# EAGLE schematic pdp8i-io (EAGLE 6.6.0), part 2 of 2
## Sheet 25 of 40
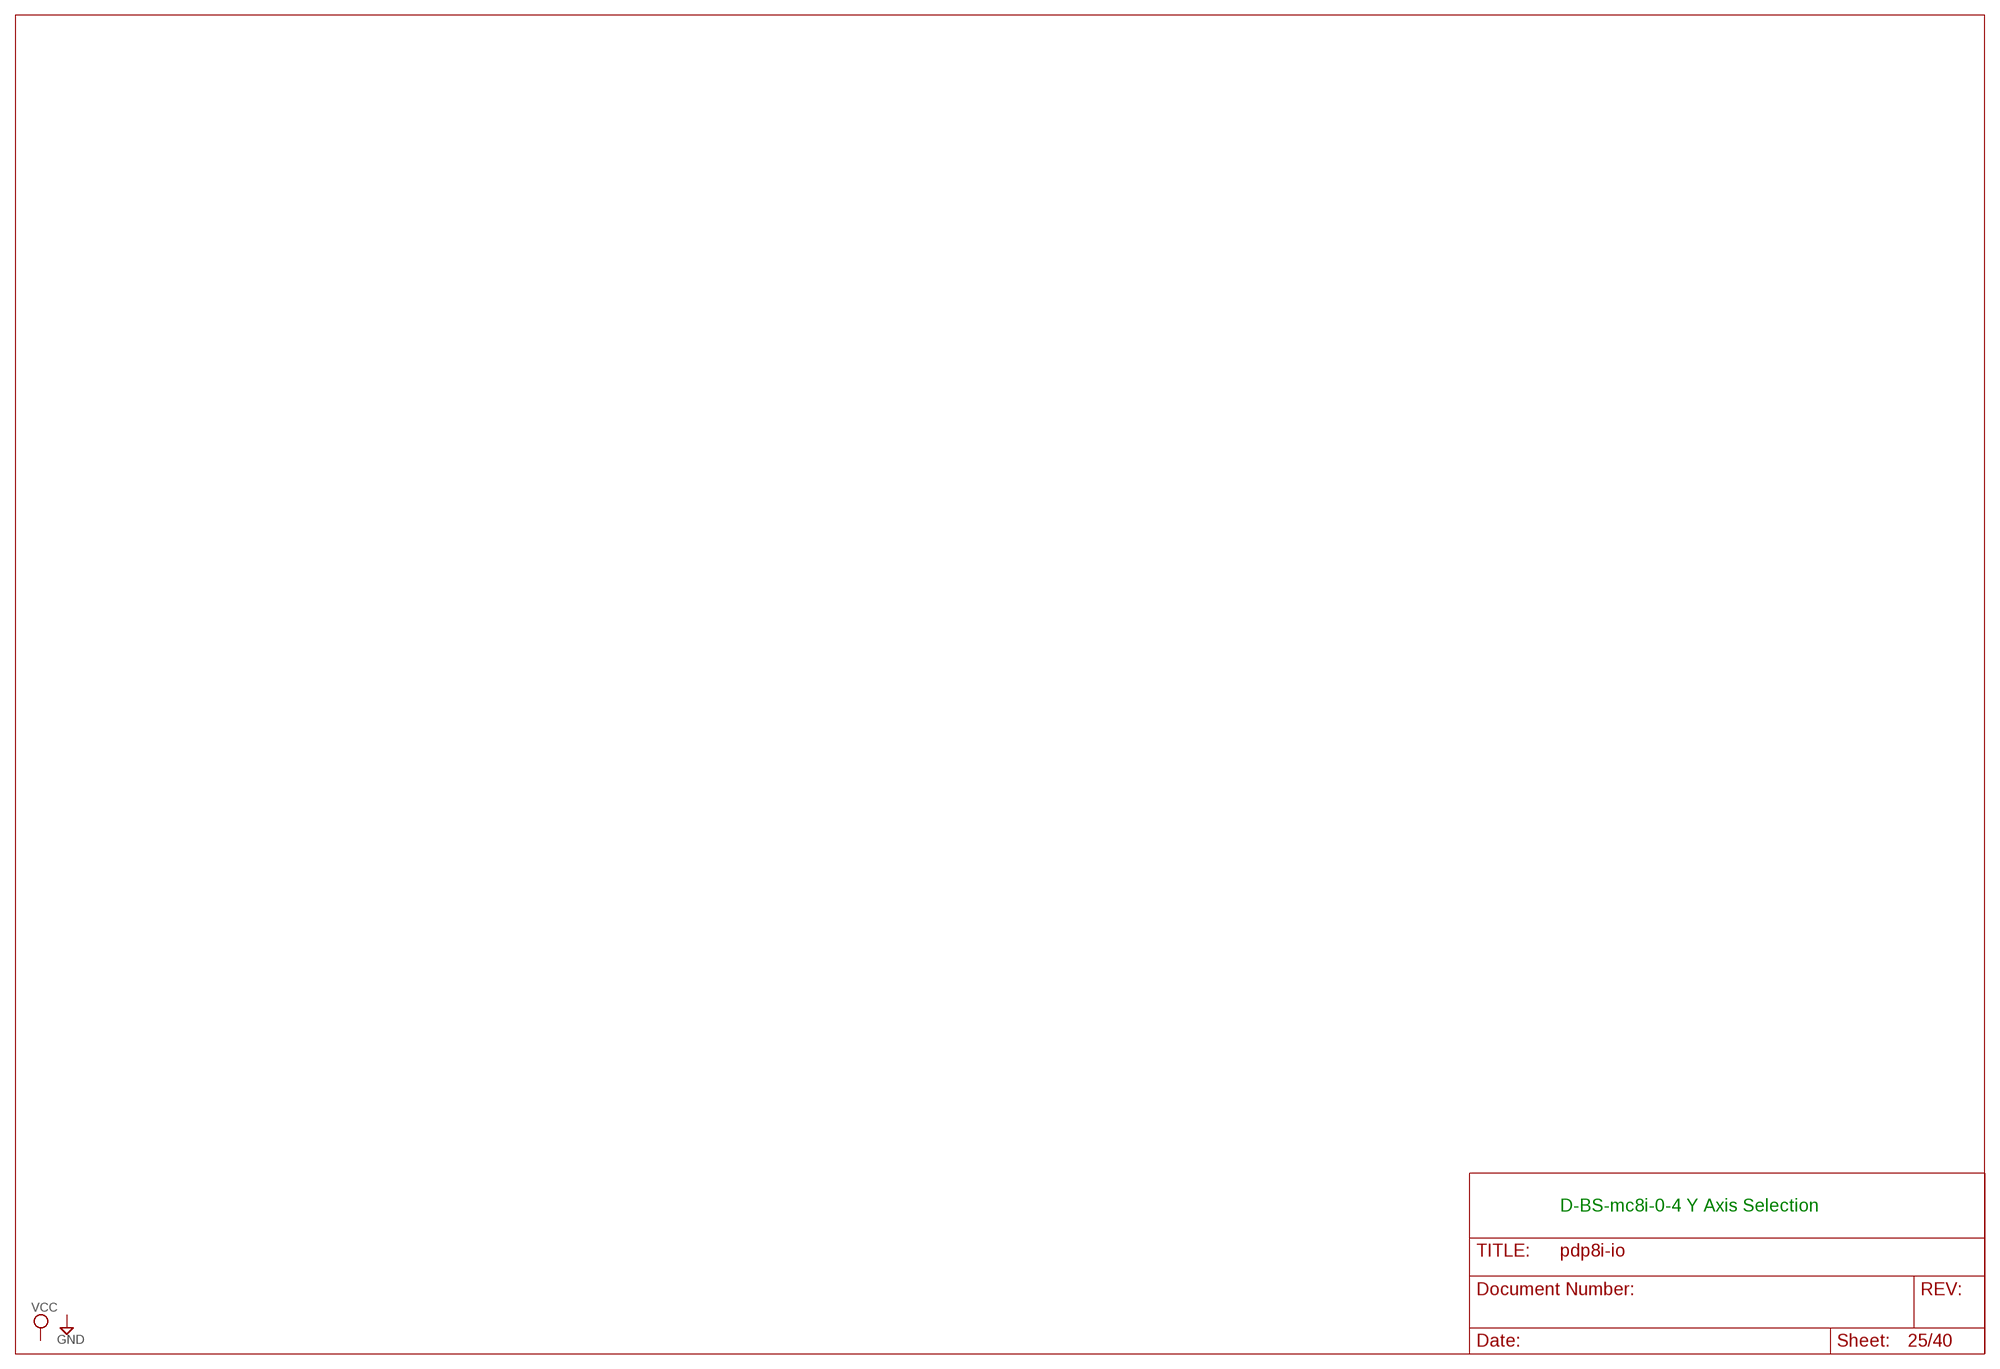
[diagram p24: schematic, sheet 25]

### Notes on the sheet
- D-BS-mc8i-0-4 Y Axis Selection

## Sheet 26 of 40
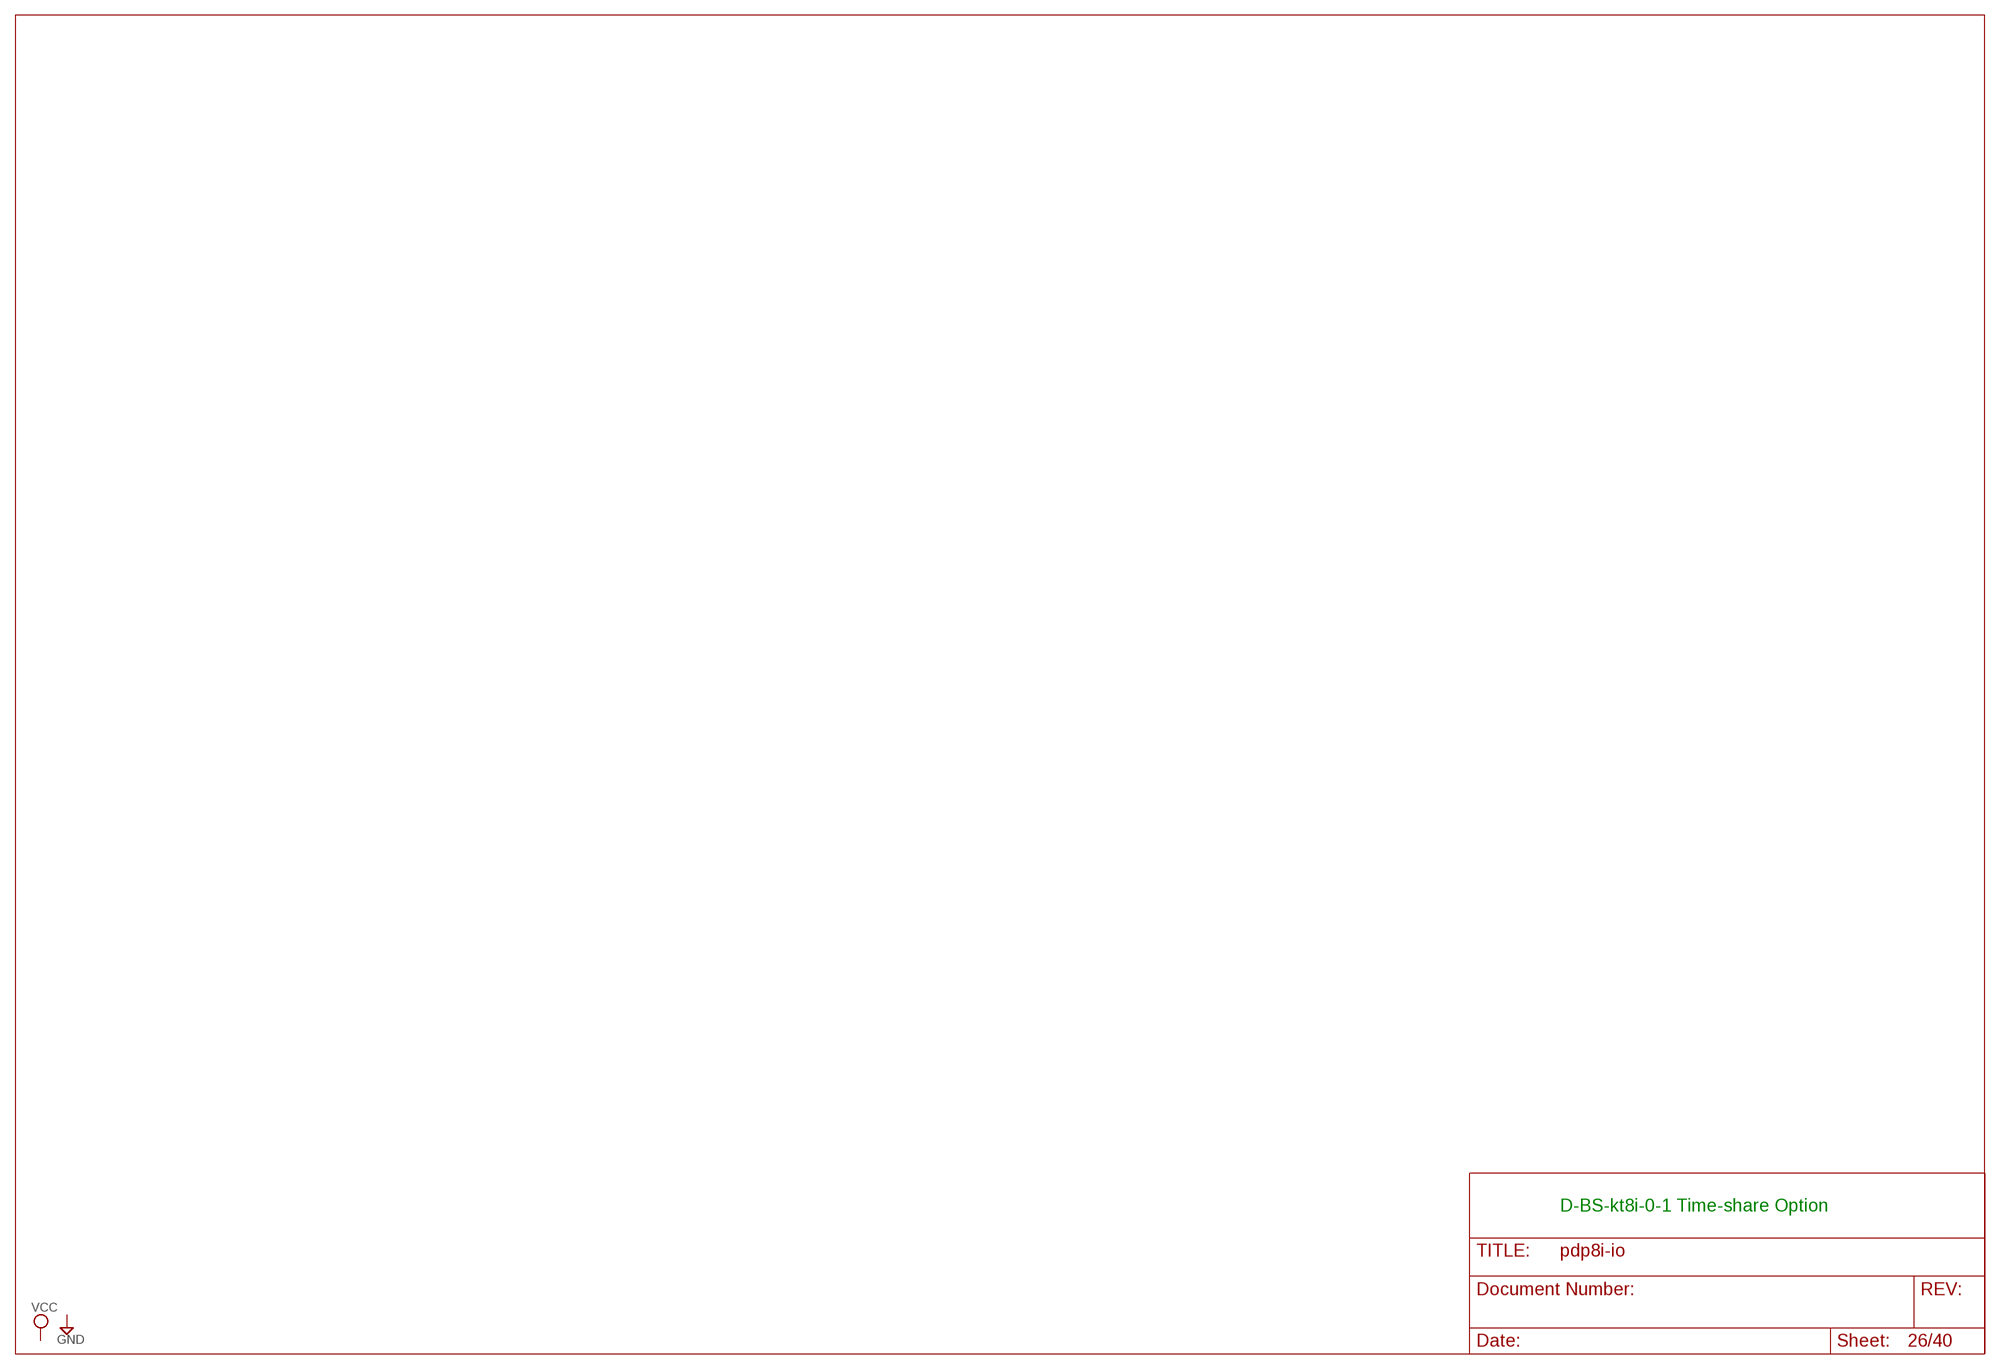
[diagram p25: schematic, sheet 26]

### Notes on the sheet
- D-BS-kt8i-0-1 Time-share Option

## Sheet 27 of 40
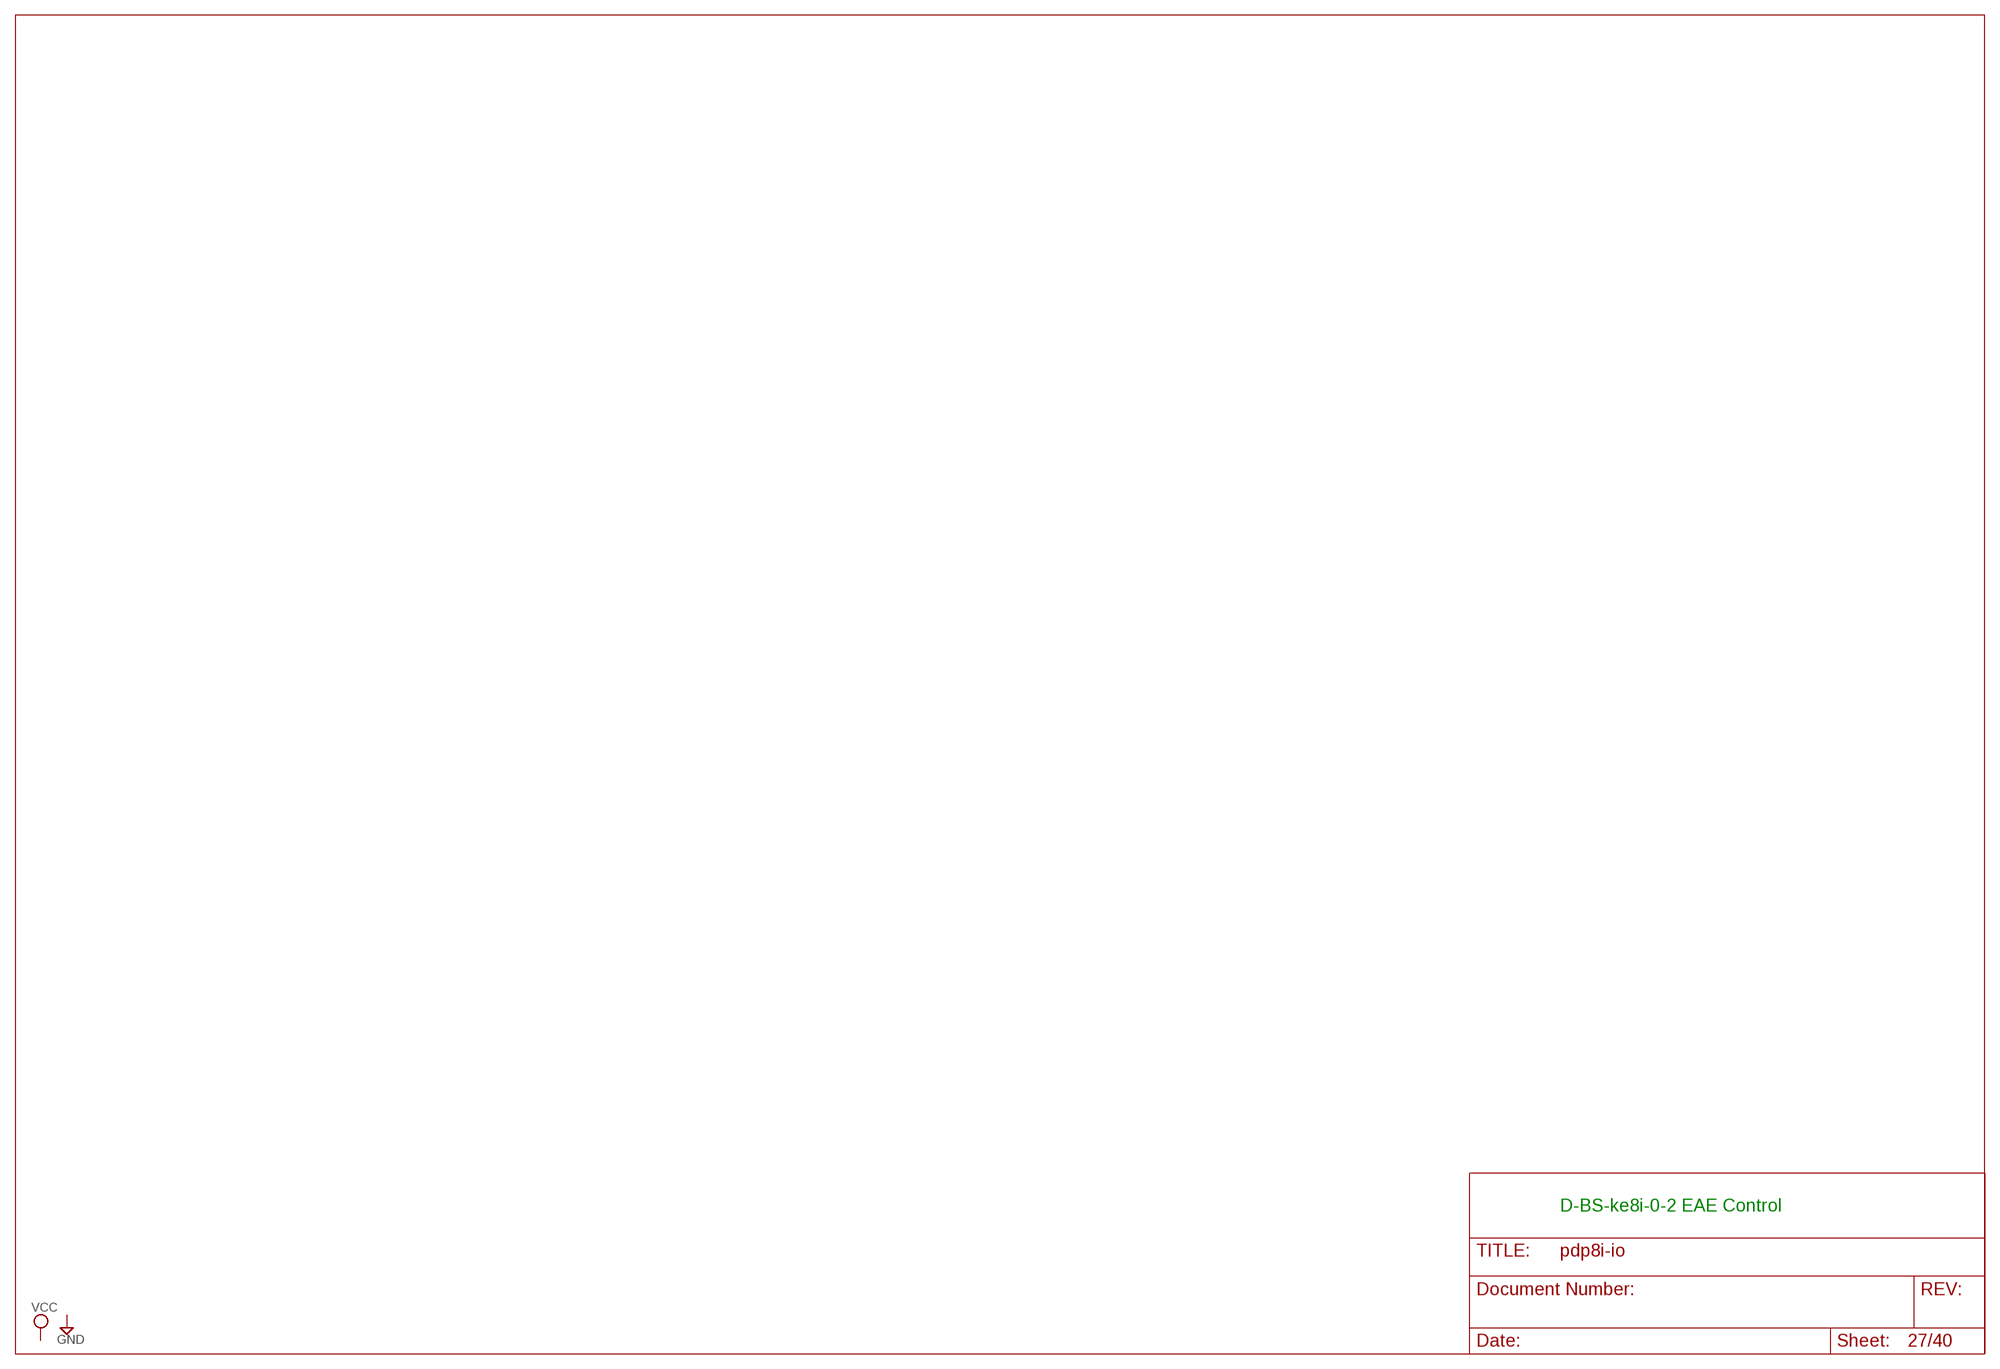
[diagram p26: schematic, sheet 27]

### Notes on the sheet
- D-BS-ke8i-0-2 EAE Control

## Sheet 28 of 40
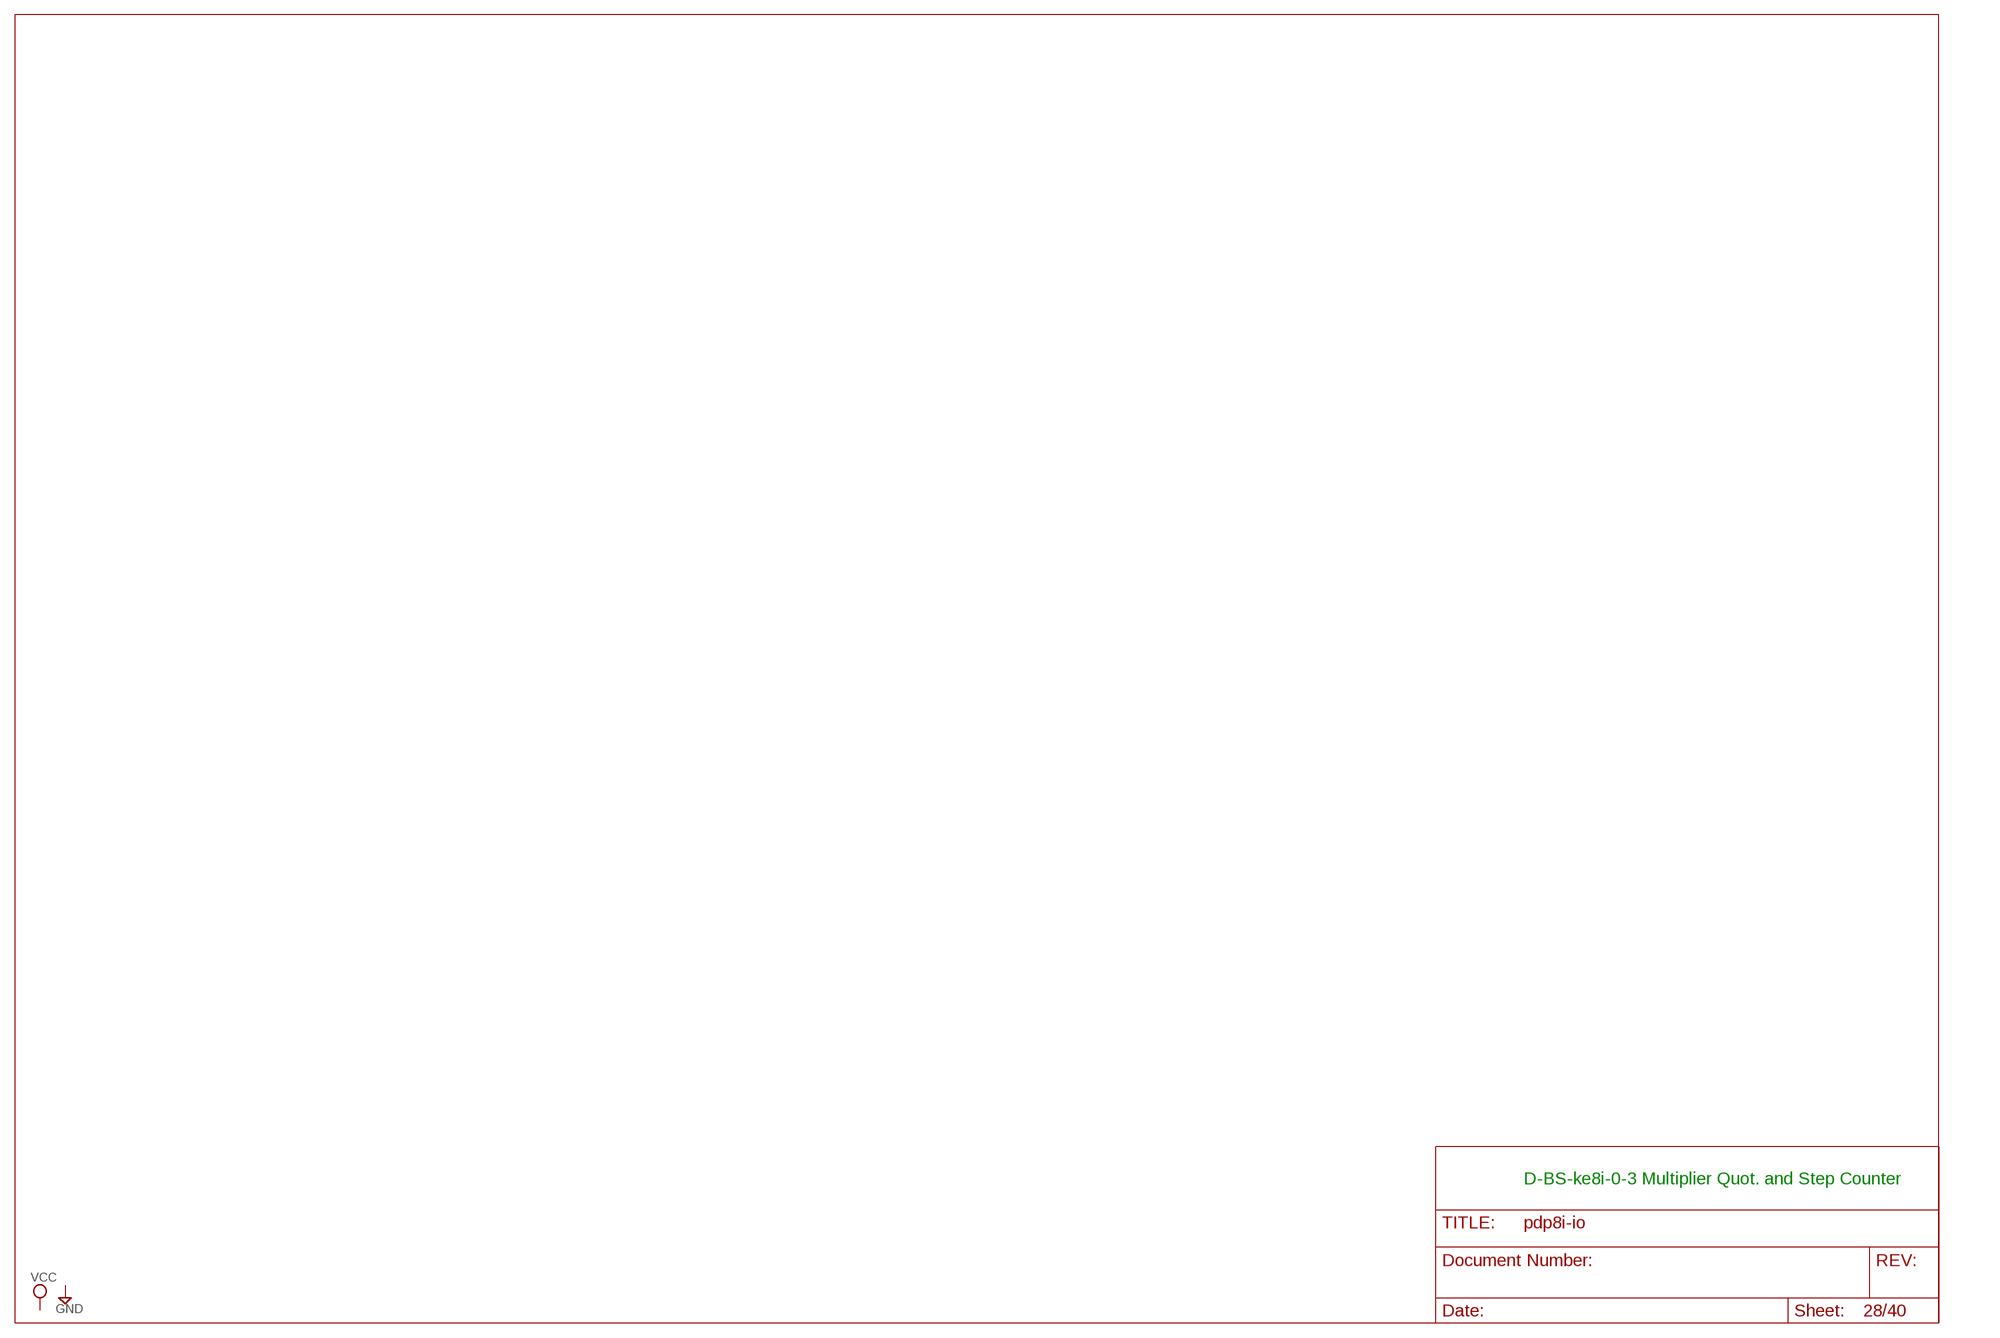
[diagram p27: schematic, sheet 28]

### Notes on the sheet
- D-BS-ke8i-0-3 Multiplier Quot. and Step Counter

## Sheet 29 of 40
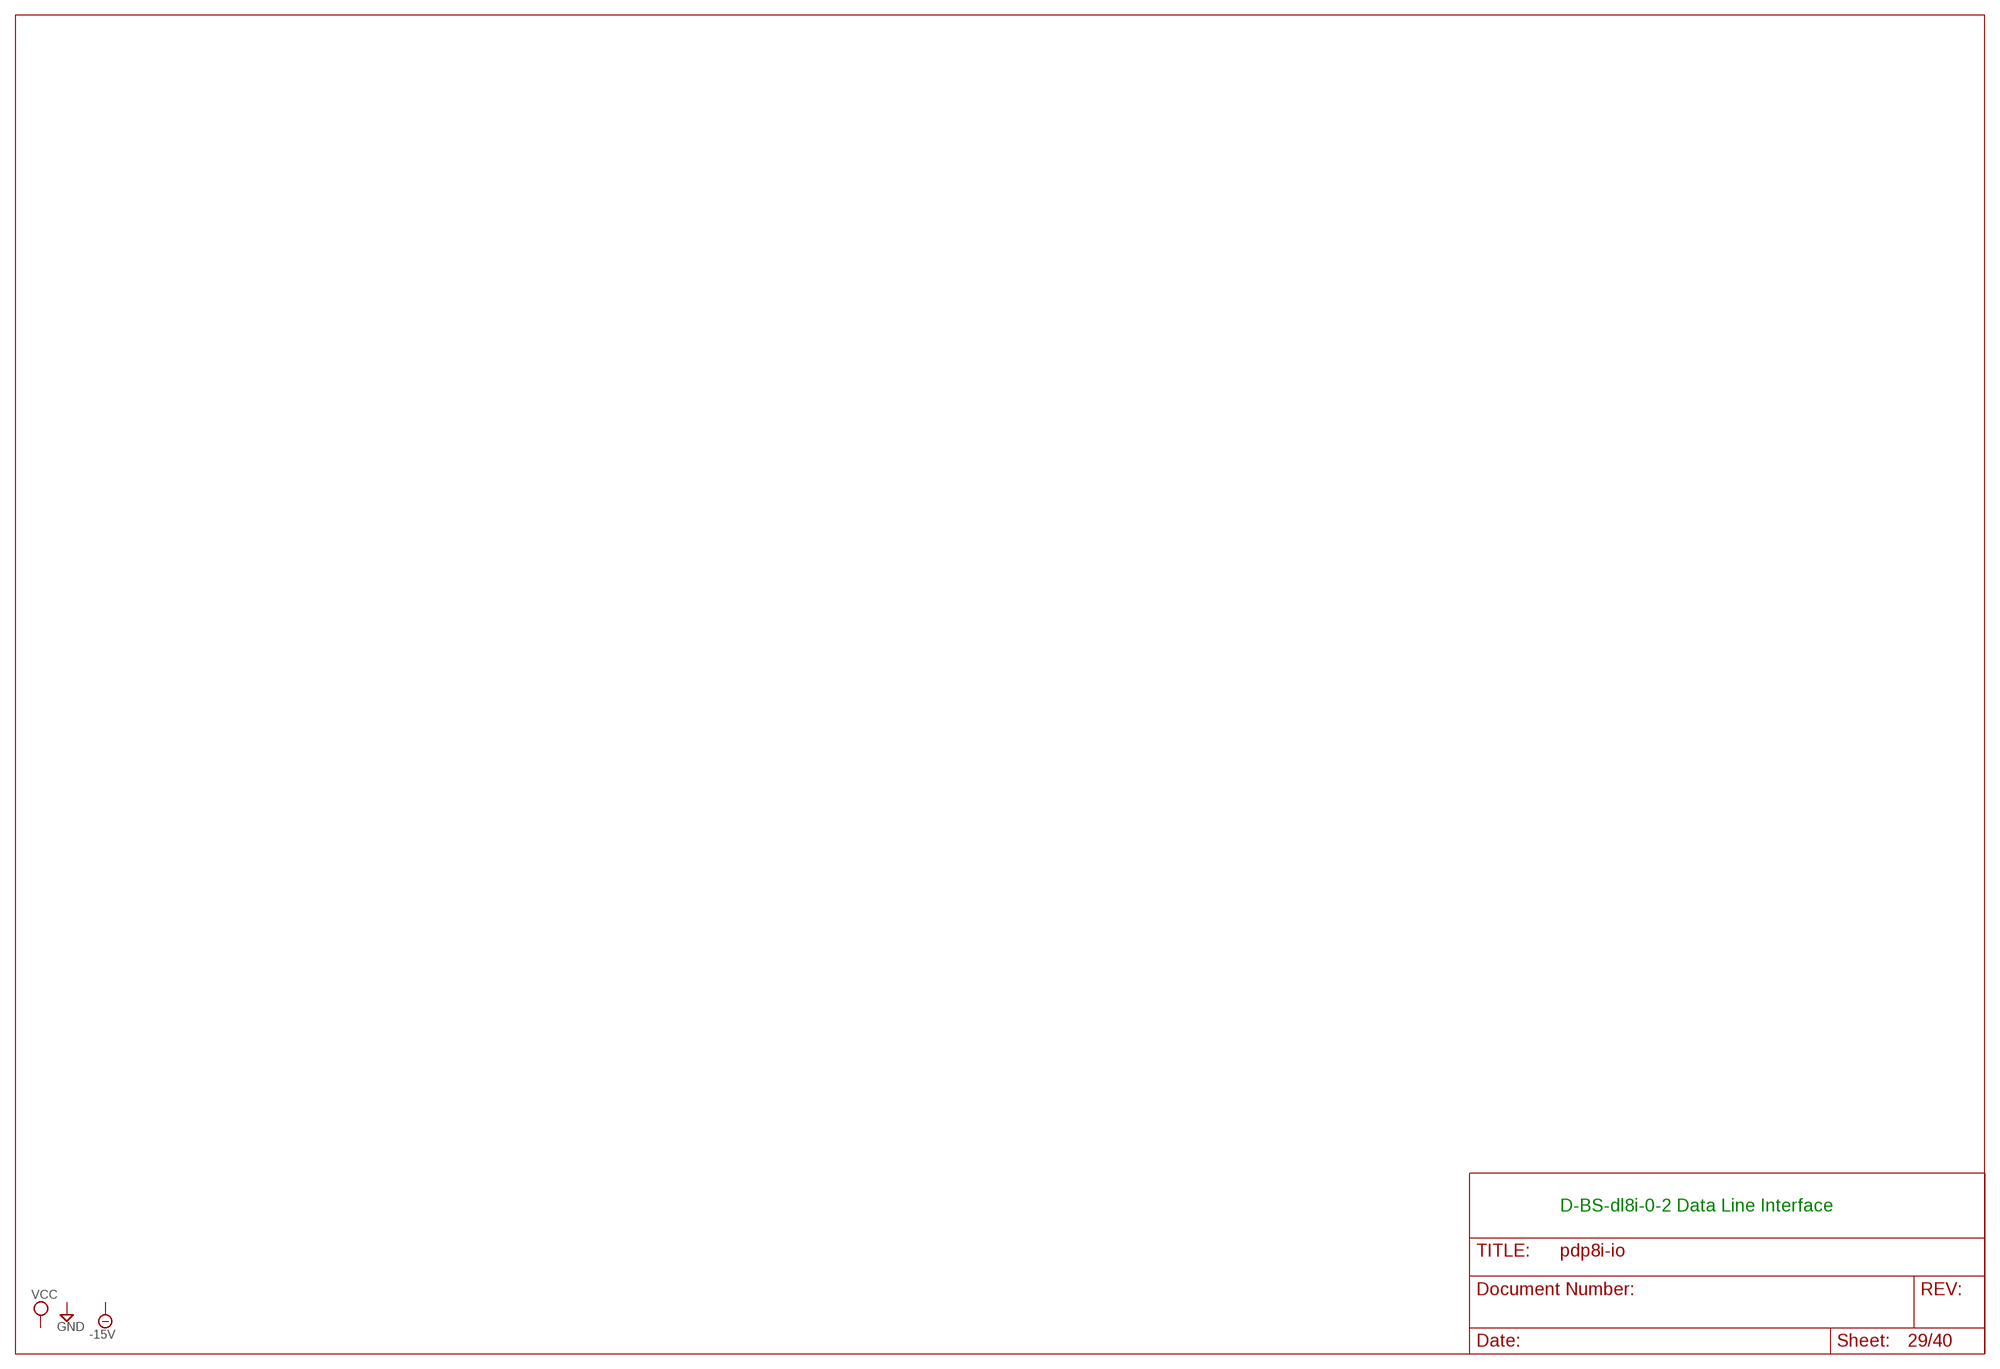
[diagram p28: schematic, sheet 29]

### Notes on the sheet
- D-BS-dl8i-0-2 Data Line Interface

## Sheet 30 of 40
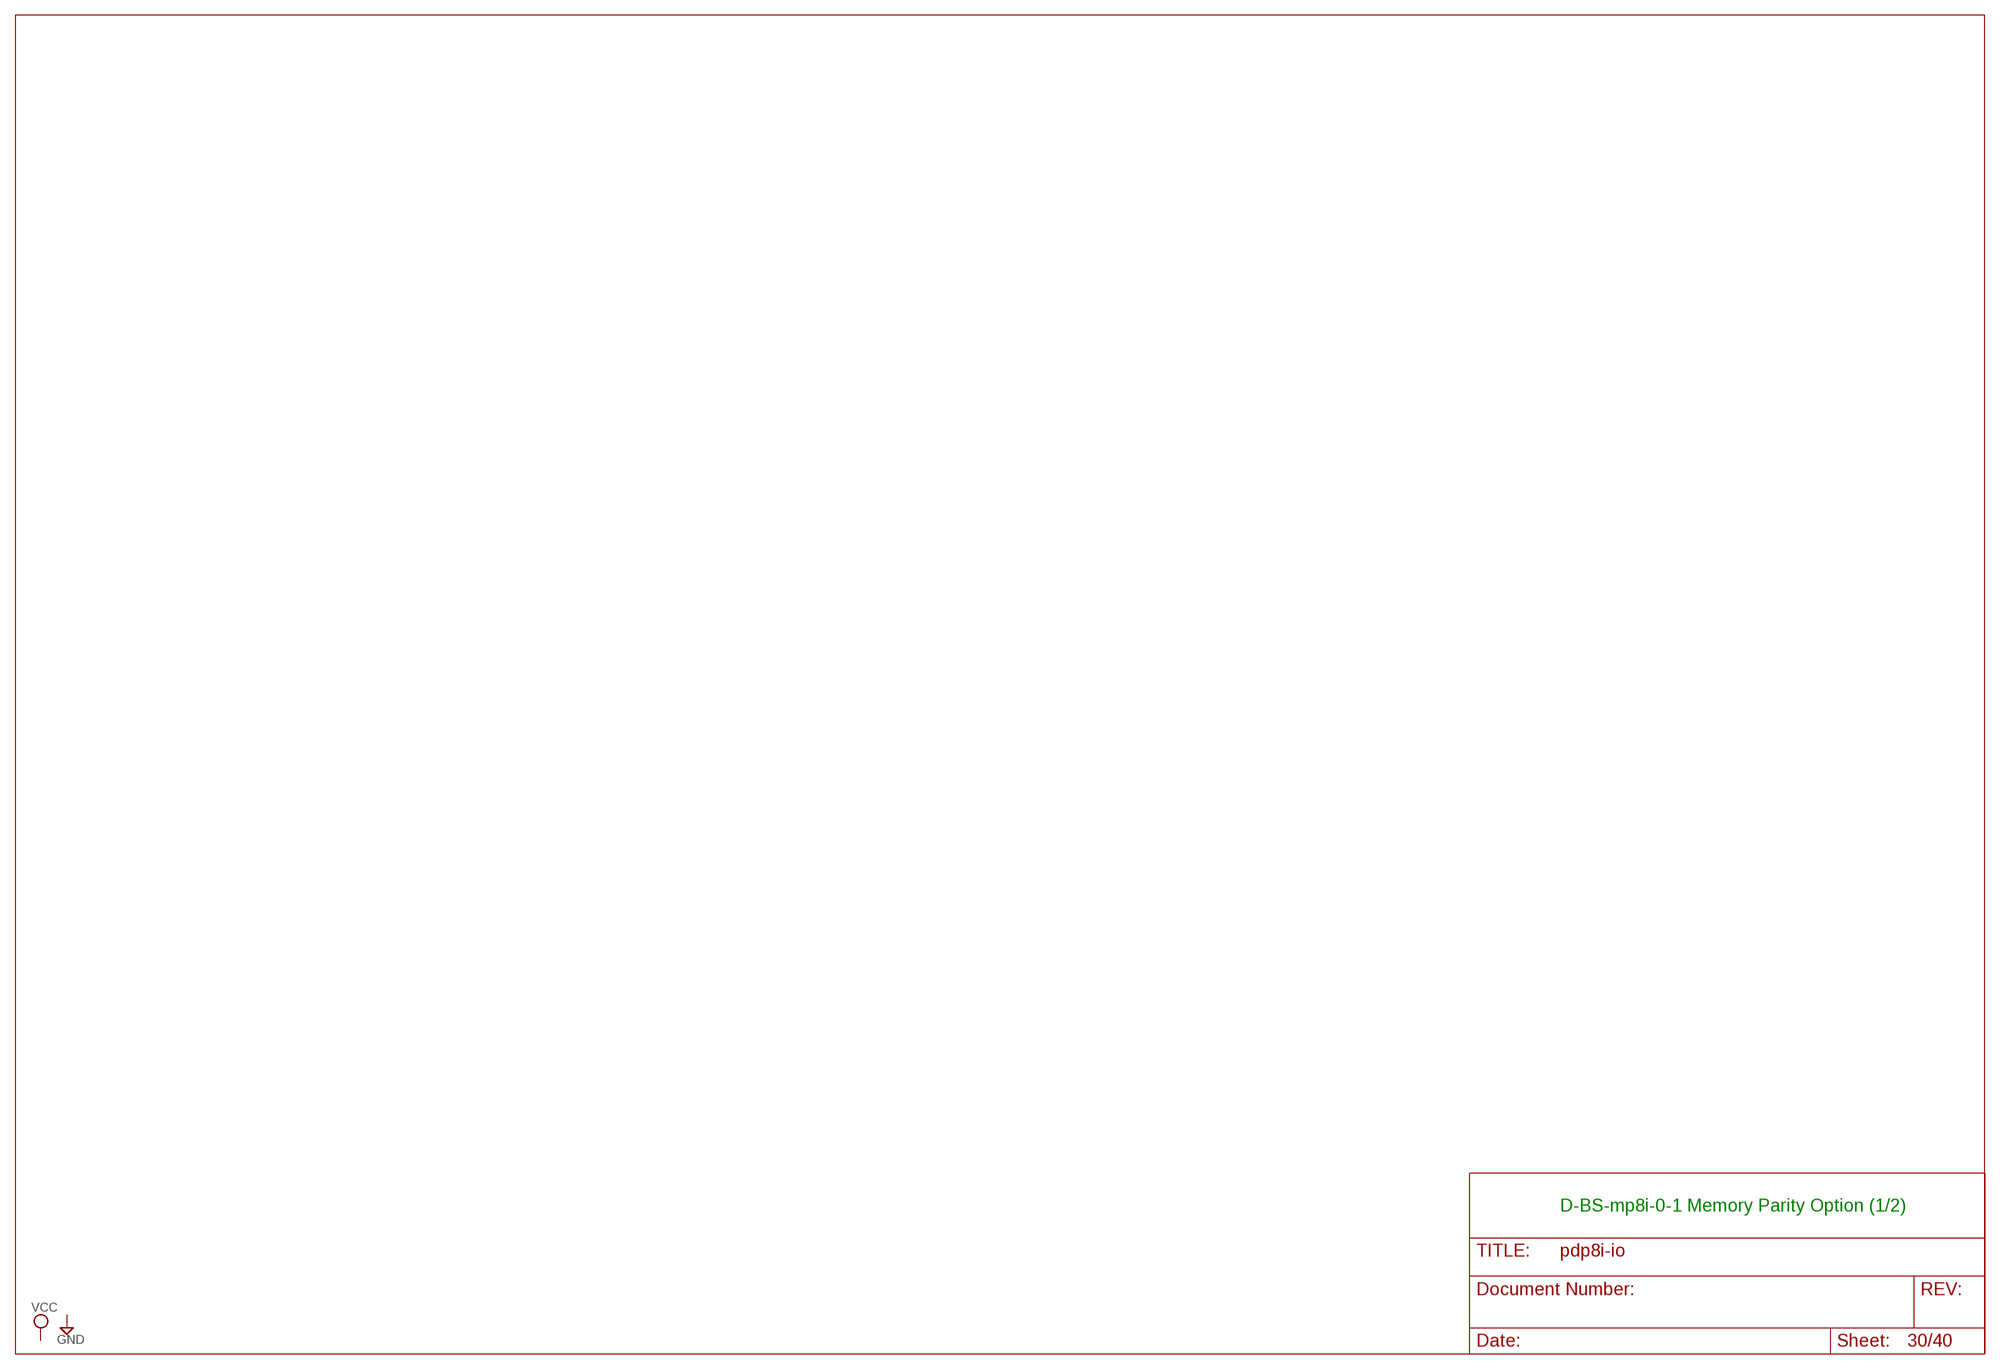
[diagram p29: schematic, sheet 30]

### Notes on the sheet
- D-BS-mp8i-0-1 Memory Parity Option (1/2)

## Sheet 31 of 40
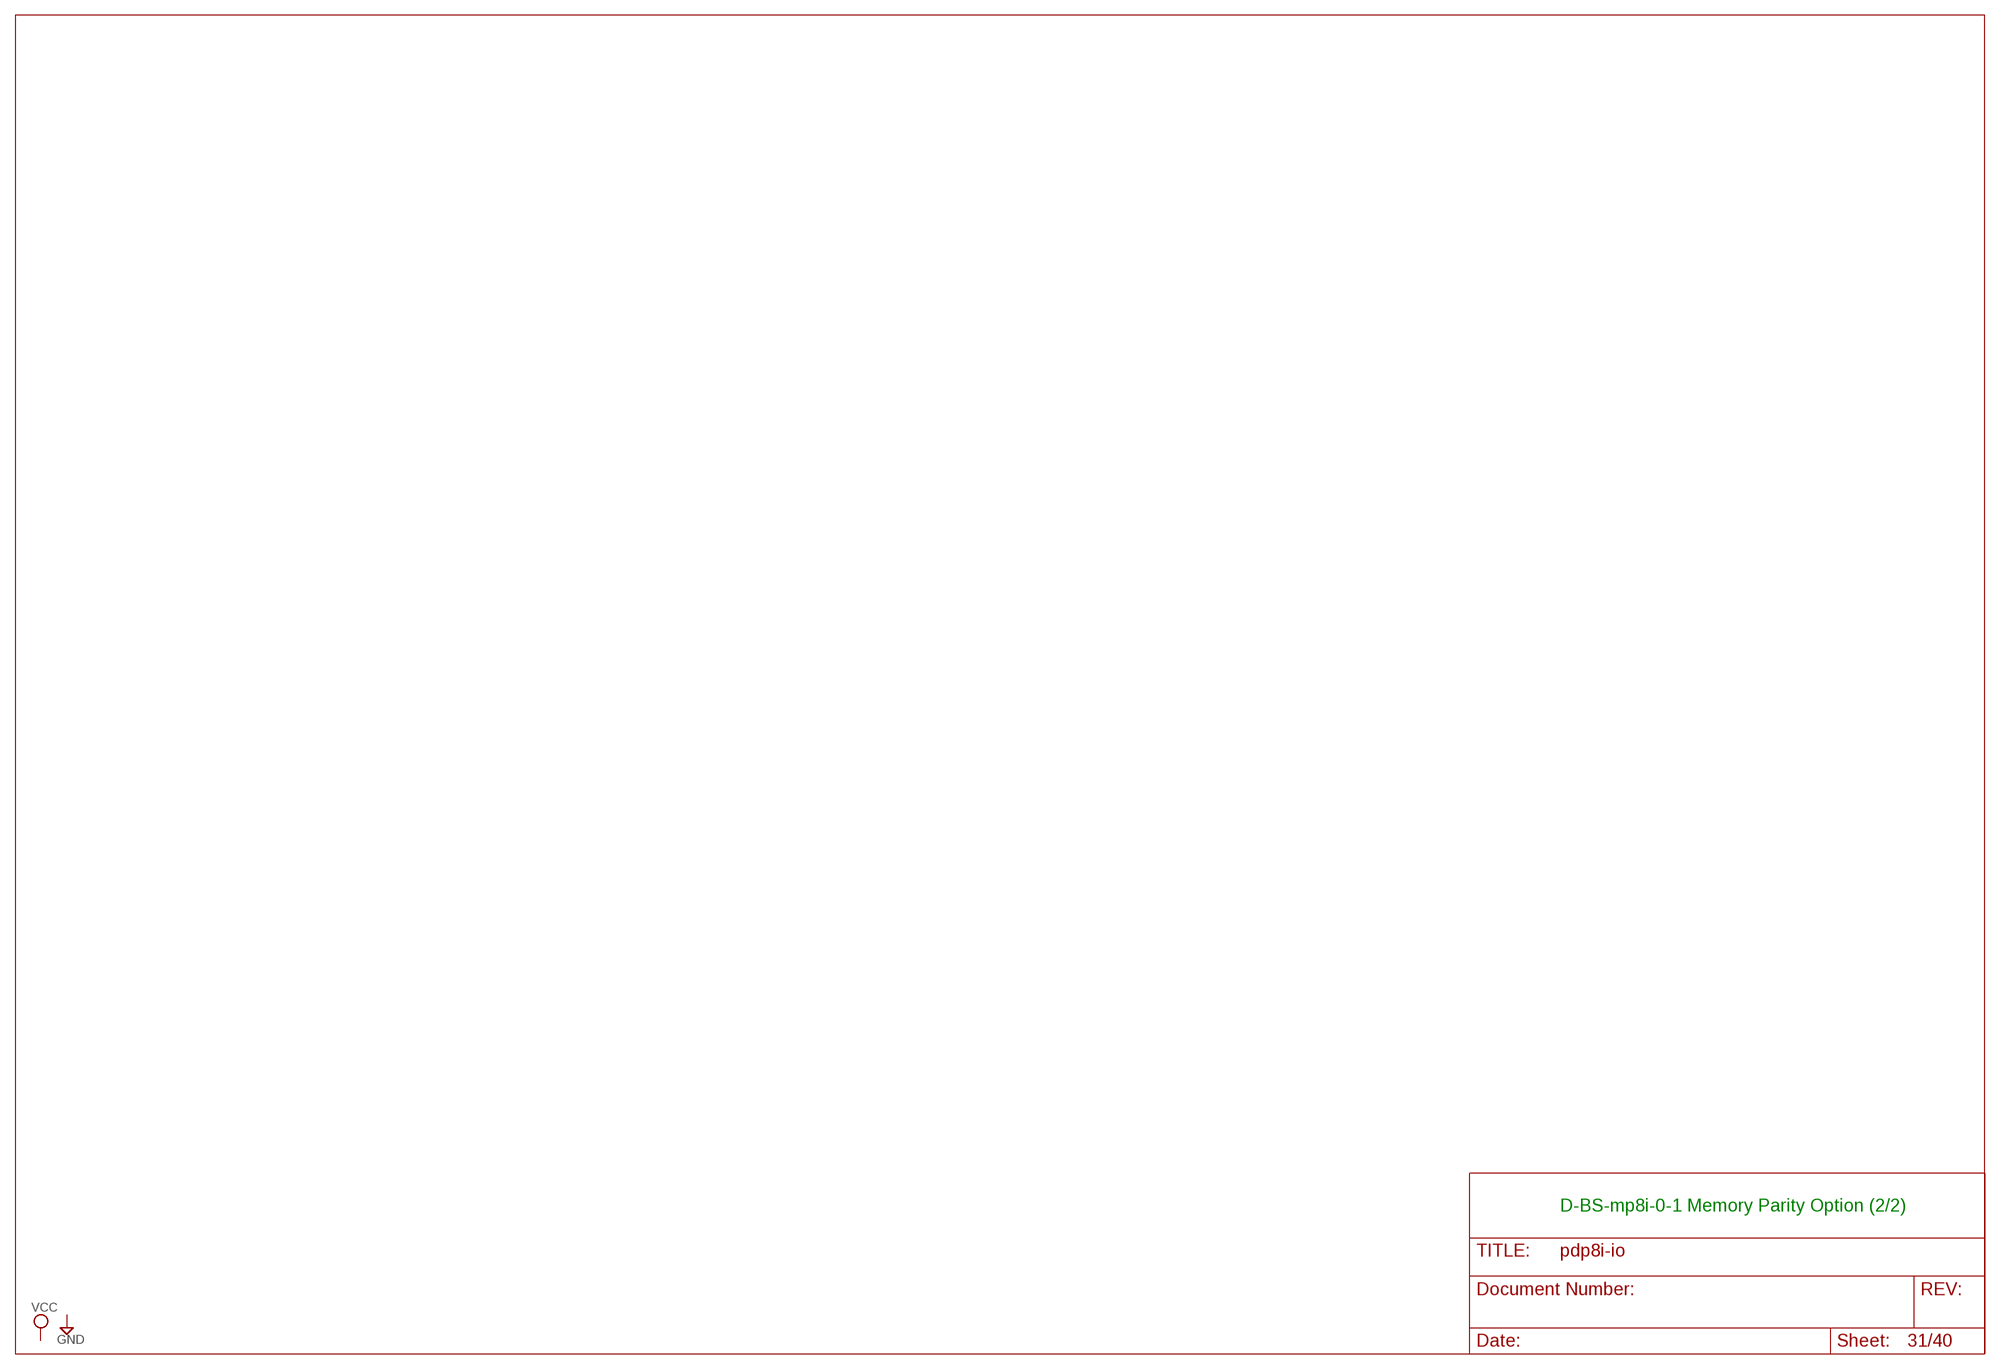
[diagram p30: schematic, sheet 31]

### Notes on the sheet
- D-BS-mp8i-0-1 Memory Parity Option (2/2)

## Sheet 32 of 40
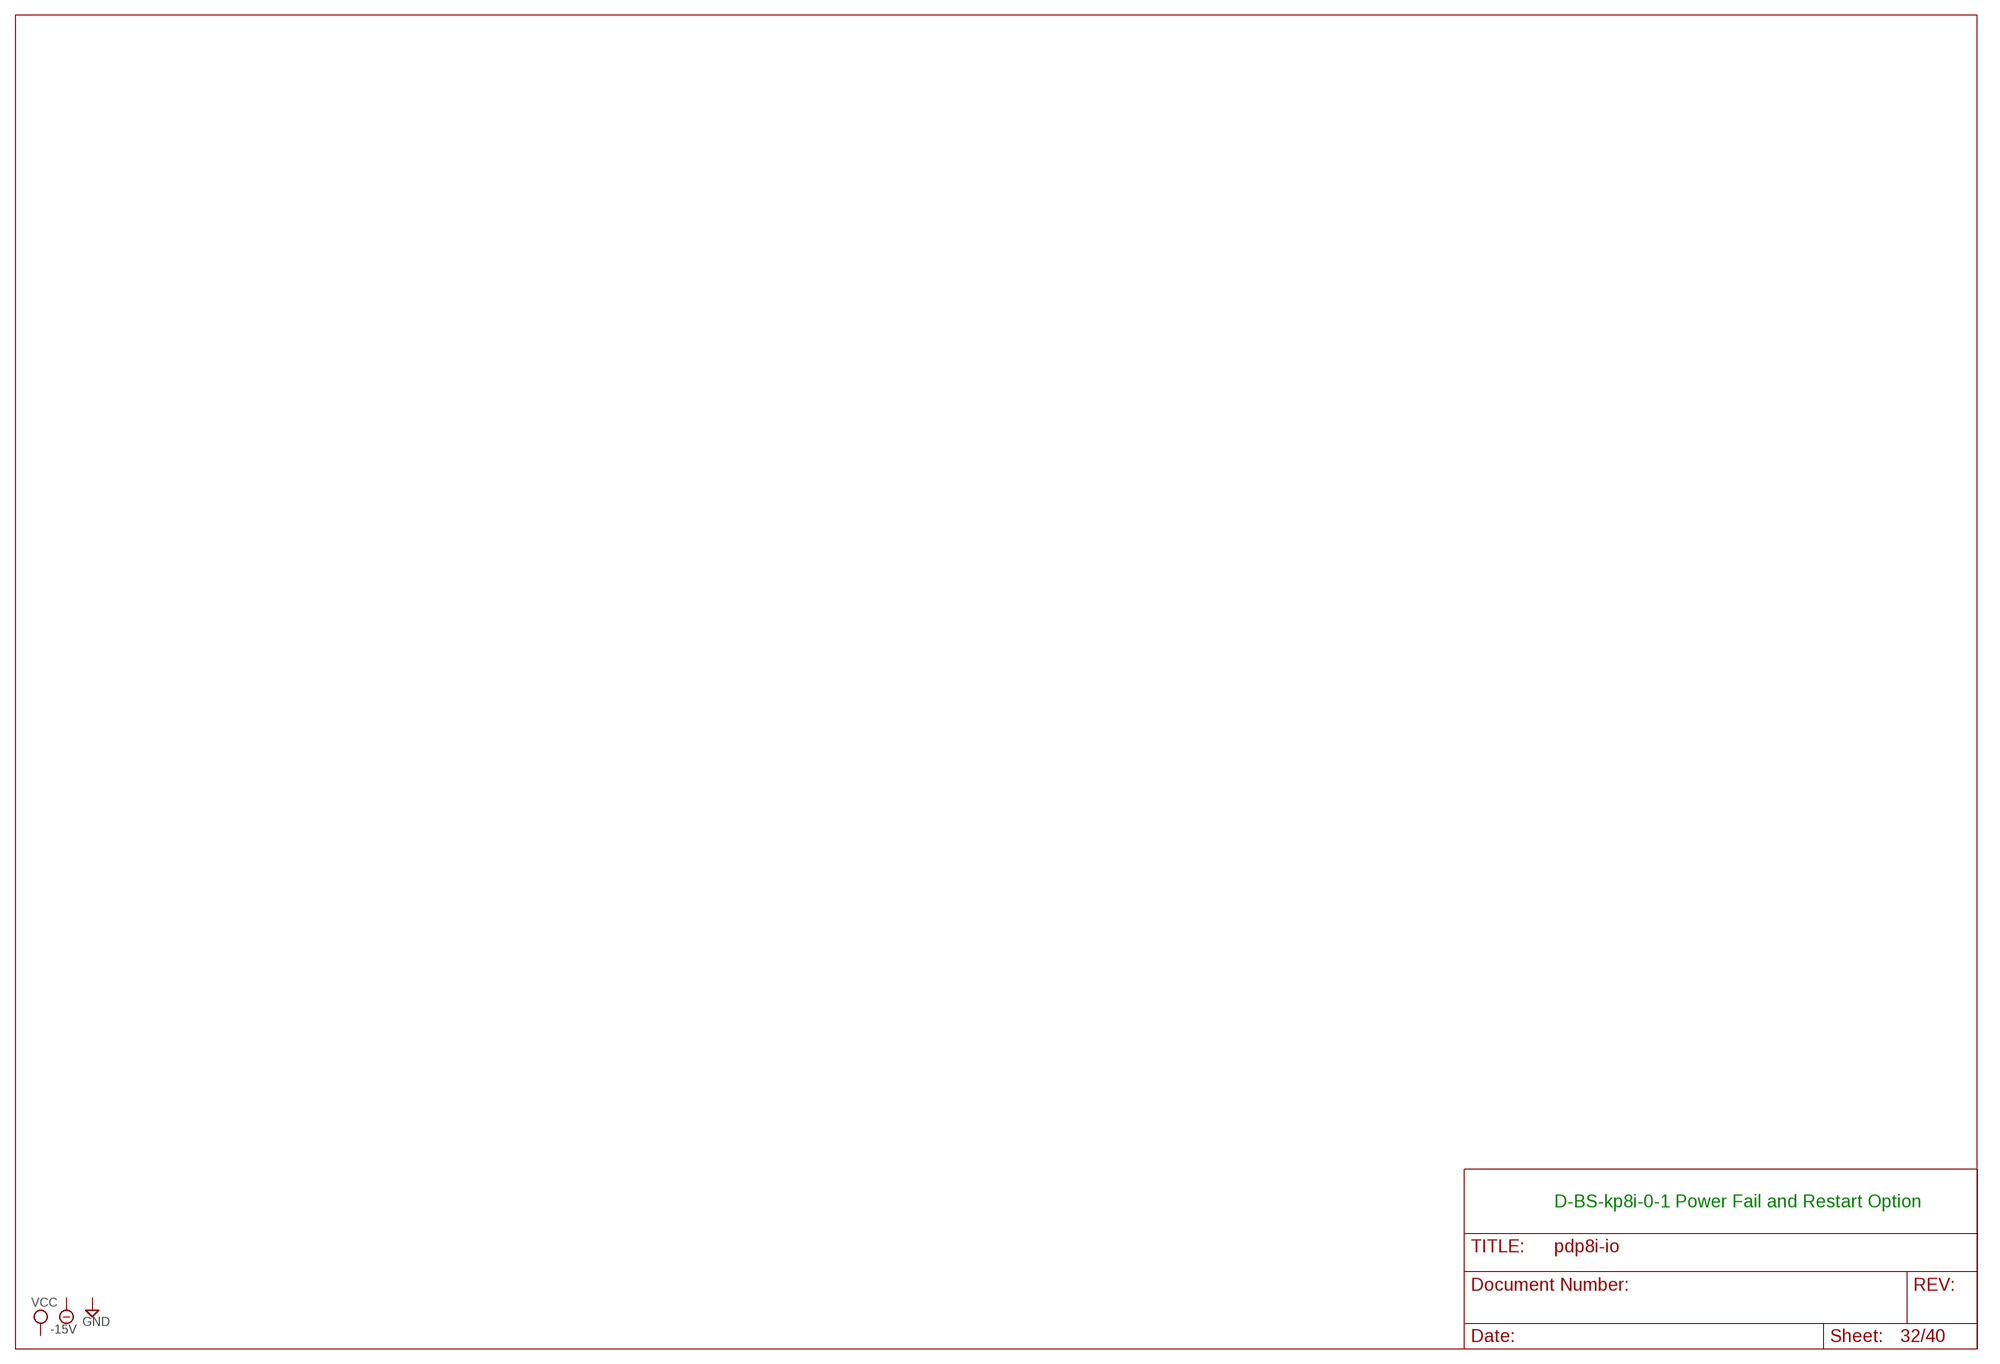
[diagram p31: schematic, sheet 32]

### Notes on the sheet
- D-BS-kp8i-0-1 Power Fail and Restart Option

## Sheet 33 of 40
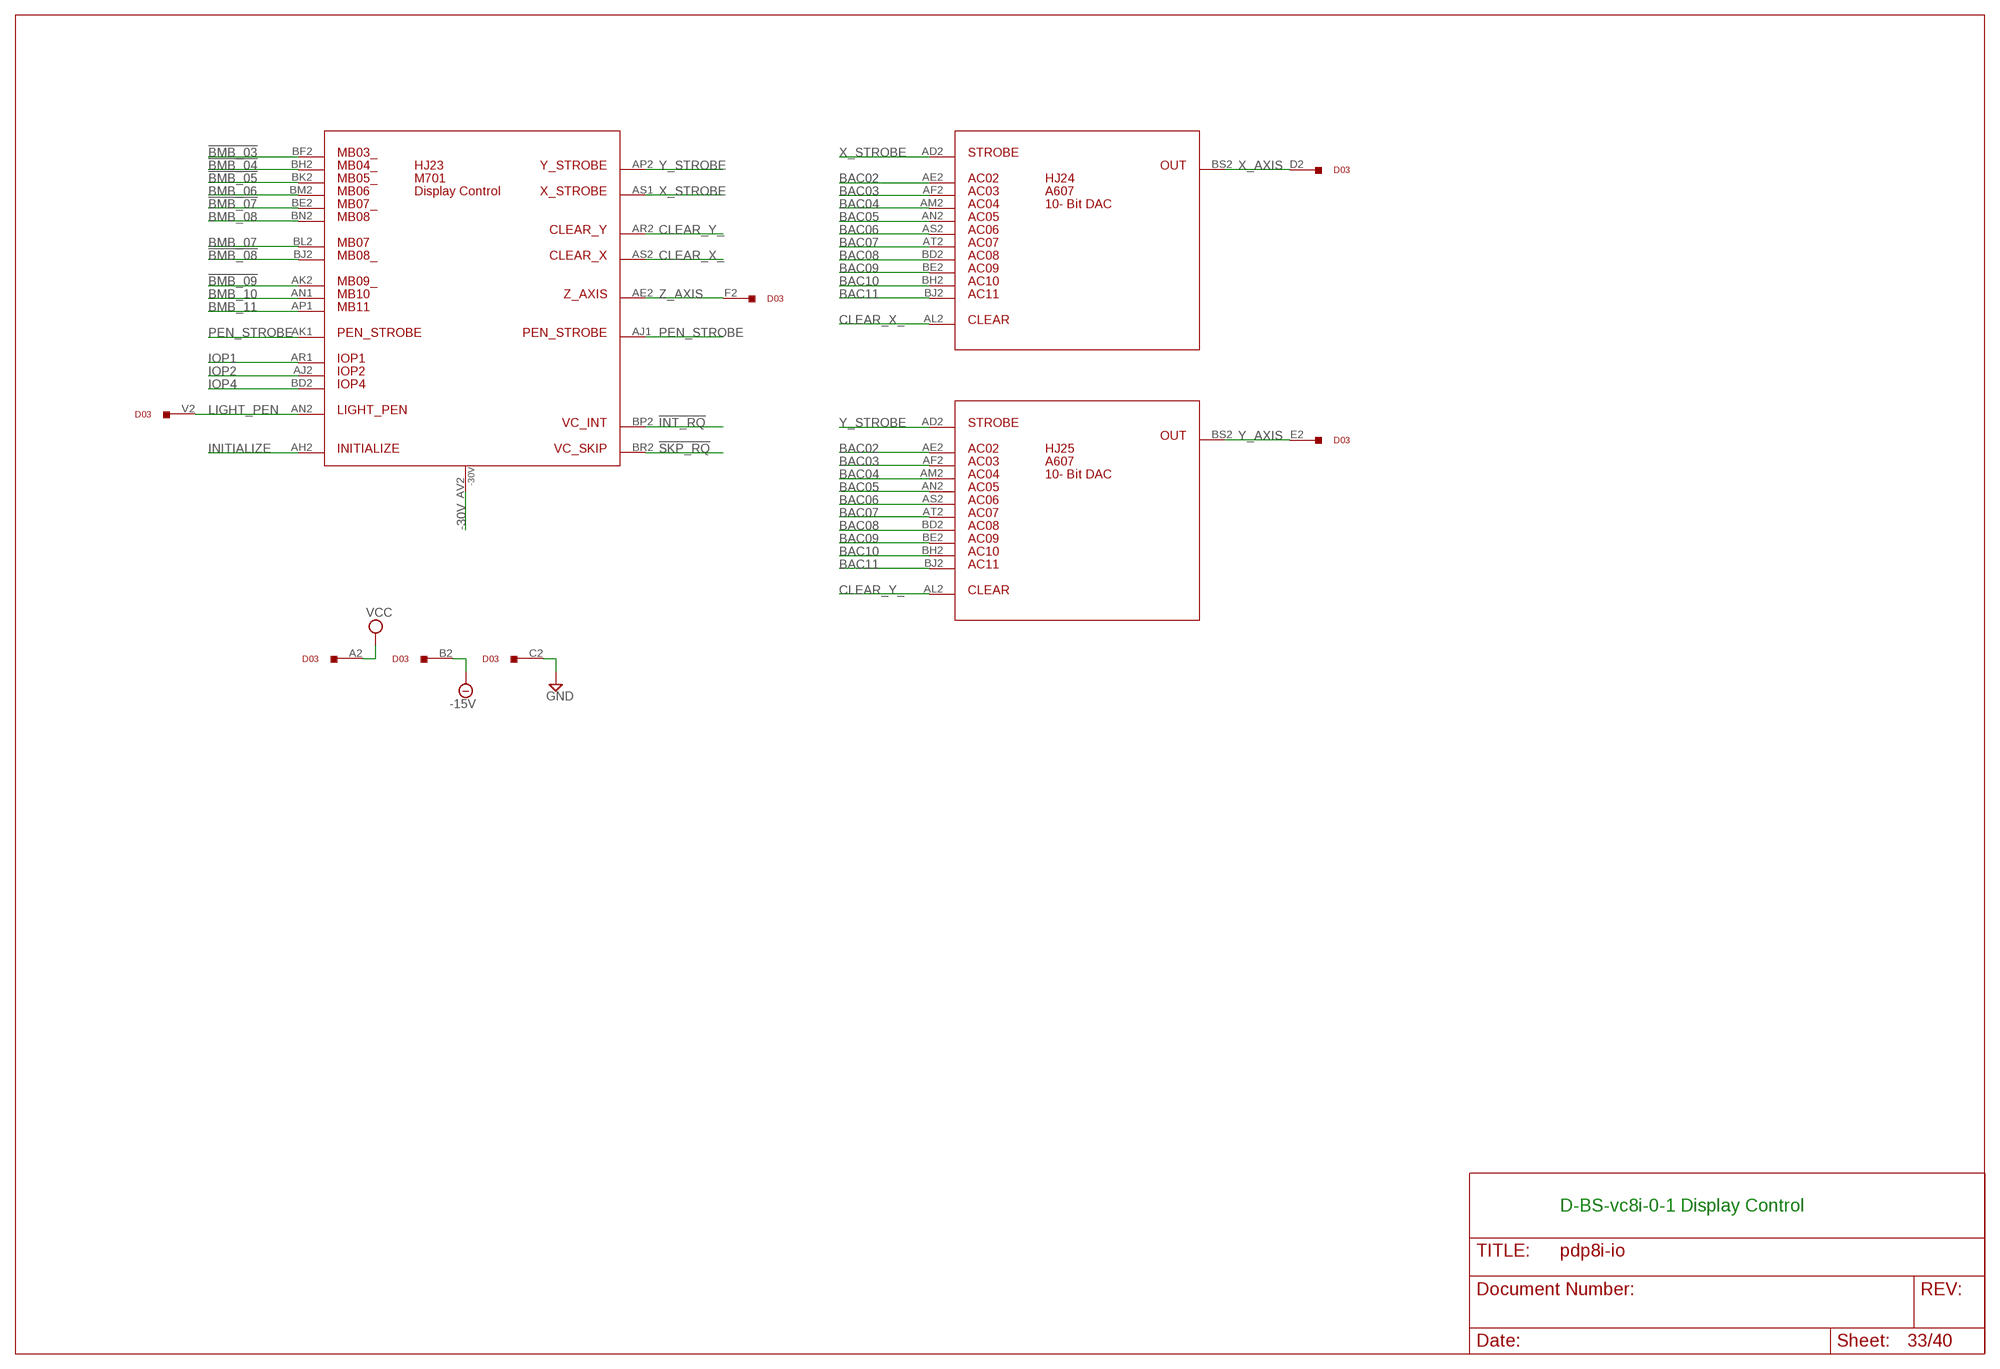
[diagram p32: schematic, sheet 33]

### Parts
D03  W023  [H807]
HJ23  M701  [H807-2]
HJ24  A607  [H807-2]
HJ25  A607  [H807-2]

### Nets
!BMB_03: HJ23.BF2 ; also sheet 13,15,16,35,36,37
!BMB_04: HJ23.BH2 ; also sheet 13,15,16,34,35,36,37
!BMB_05: HJ23.BK2 ; also sheet 13,15,16,35,36,38
!BMB_07: HJ23.BE2 ; also sheet 13,16,34,36
!BMB_08: HJ23.BJ2 ; also sheet 13,16,34,35
!BMB_09: HJ23.AK2 ; also sheet 13,37
!INT_RQ: HJ23.BP2 ; also sheet 13,34,35,36,37,38
!SKP_RQ: HJ23.BR2 ; also sheet 13,34,35,36,37,38
-15V [Suppply]: D03.B2 ; also sheet 36
-30V [Suppply]: HJ23.AV2(-30V) ; also sheet 15
BAC02: HJ24.AE2 HJ25.AE2 ; also sheet 13,14,37
BAC03: HJ24.AF2 HJ25.AF2 ; also sheet 13,14,37
BAC04: HJ24.AM2 HJ25.AM2 ; also sheet 13,14,16,35,37
BAC05: HJ24.AN2 HJ25.AN2 ; also sheet 13,14,16,35,37
BAC06: HJ24.AS2 HJ25.AS2 ; also sheet 13,14,16,35,37
BAC07: HJ24.AT2 HJ25.AT2 ; also sheet 13,14,16,35,37
BAC08: HJ24.BD2 HJ25.BD2 ; also sheet 13,14,16,35,37
BAC09: HJ24.BE2 HJ25.BE2 ; also sheet 13,14,16,35,37
BAC10: HJ24.BH2 HJ25.BH2 ; also sheet 13,14,16,35,37
BAC11: HJ24.BJ2 HJ25.BJ2 ; also sheet 13,14,16,35,37
BMB_06: HJ23.BM2 ; also sheet 13,16,38
BMB_07: HJ23.BL2 ; also sheet 13,15,34,35,37,38
BMB_08: HJ23.BN2 ; also sheet 13,15,34,36,37,38
BMB_10: HJ23.AN1 ; also sheet 13,37
BMB_11: HJ23.AP1 ; also sheet 13,37
CLEAR_X_: HJ23.AS2 HJ24.AL2
CLEAR_Y_: HJ23.AR2 HJ25.AL2
GND [Suppply]: D03.C2 ; also sheet 13,15,16,34,35,39
INITIALIZE: HJ23.AH2 ; also sheet 13,15,16,34,36
IOP1: HJ23.AR1 ; also sheet 13,15,16,34,35,36
IOP2: HJ23.AJ2 ; also sheet 13,15,16,34,35,36
IOP4: HJ23.BD2 ; also sheet 13,15,16,34,35,36
LIGHT_PEN: D03.V2 HJ23.AN2
PEN_STROBE: HJ23.AJ1 HJ23.AK1
VCC [Suppply]: D03.A2 ; also sheet 13
X_AXIS: D03.D2 HJ24.BS2
X_STROBE: HJ23.AS1 HJ24.AD2
Y_AXIS: D03.E2 HJ25.BS2
Y_STROBE: HJ23.AP2 HJ25.AD2
Z_AXIS: D03.F2 HJ23.AE2
Unconnected: D03.H2 D03.J2 D03.K2 D03.L2 D03.M2 D03.N2 D03.P2 D03.R2 D03.S2 D03.T2 D03.U2

### Notes on the sheet
- D-BS-vc8i-0-1 Display Control

## Sheet 34 of 40
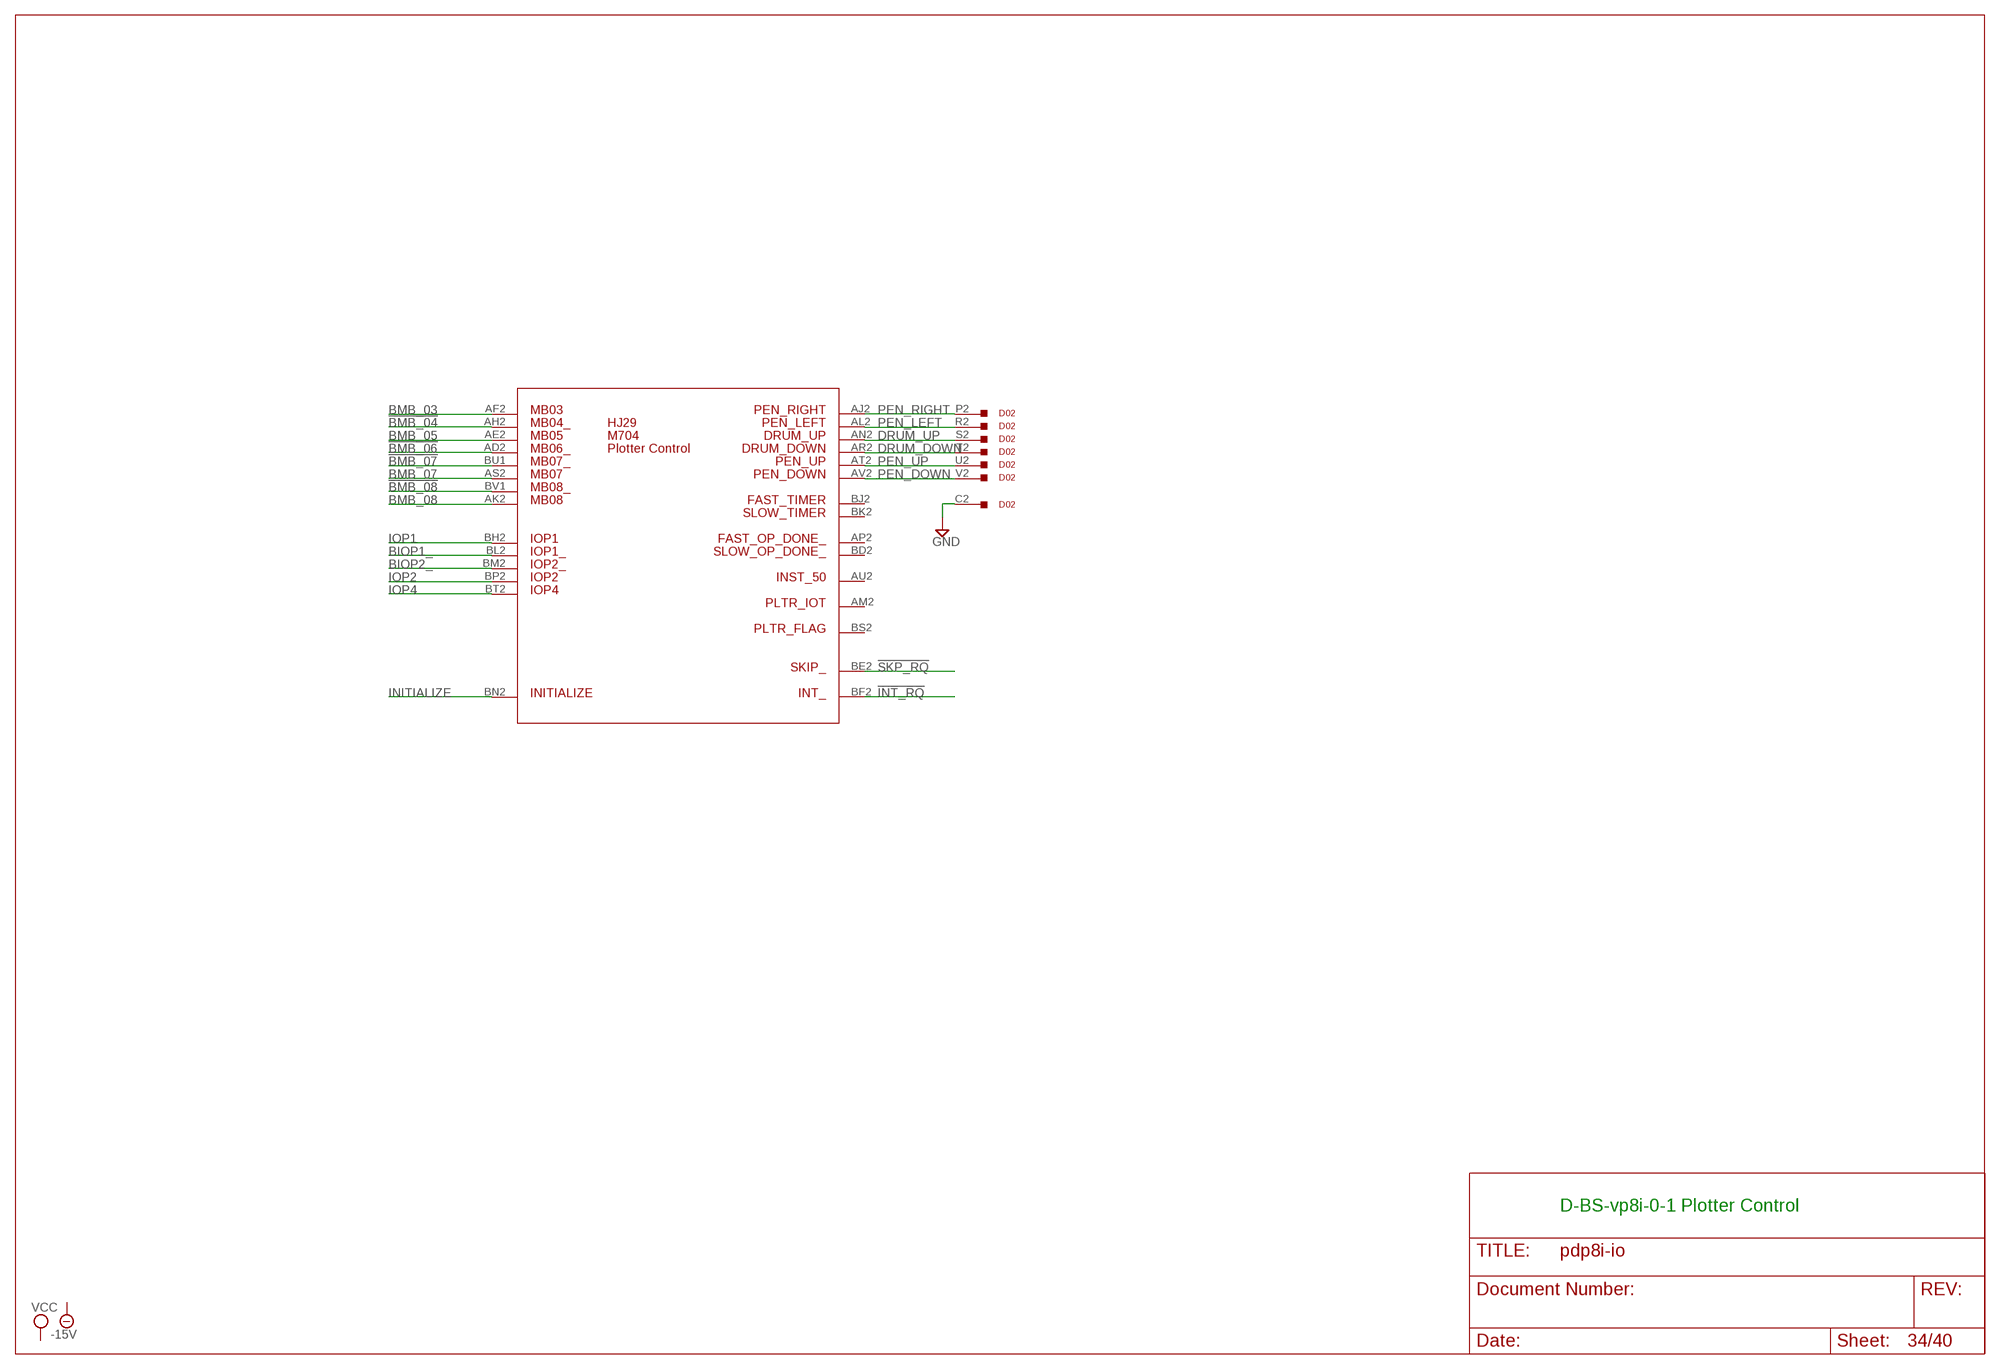
[diagram p33: schematic, sheet 34]

### Parts
D02  W023  [H807]
HJ29  M704  [H807-2]

### Nets
!BMB_04: HJ29.AH2 ; also sheet 13,15,16,33,35,36,37
!BMB_06: HJ29.AD2 ; also sheet 13,15,35,36,37,38
!BMB_07: HJ29.BU1 ; also sheet 13,16,33,36
!BMB_08: HJ29.BV1 ; also sheet 13,16,33,35
!INT_RQ: HJ29.BF2 ; also sheet 13,33,35,36,37,38
!SKP_RQ: HJ29.BE2 ; also sheet 13,33,35,36,37,38
BIOP1_: HJ29.BL2 ; also sheet 13,14,37
BIOP2_: HJ29.BM2 ; also sheet 13,14,37
BMB_03: HJ29.AF2 ; also sheet 13,38
BMB_05: HJ29.AE2 ; also sheet 13,37
BMB_07: HJ29.AS2 ; also sheet 13,15,33,35,37,38
BMB_08: HJ29.AK2 ; also sheet 13,15,33,36,37,38
DRUM_DOWN: D02.T2 HJ29.AR2
DRUM_UP: D02.S2 HJ29.AN2
GND [Suppply]: D02.C2 ; also sheet 13,15,16,33,35,39
INITIALIZE: HJ29.BN2 ; also sheet 13,15,16,33,36
IOP1: HJ29.BH2 ; also sheet 13,15,16,33,35,36
IOP2: HJ29.BP2 ; also sheet 13,15,16,33,35,36
IOP4: HJ29.BT2 ; also sheet 13,15,16,33,35,36
PEN_DOWN: D02.V2 HJ29.AV2
PEN_LEFT: D02.R2 HJ29.AL2
PEN_RIGHT: D02.P2 HJ29.AJ2
PEN_UP: D02.U2 HJ29.AT2
Unconnected: D02.A2 D02.B2 D02.D2 D02.E2 D02.F2 D02.H2 D02.J2 D02.K2 D02.L2 D02.M2 D02.N2 HJ29.AM2 HJ29.AP2 HJ29.AU2 HJ29.BD2 HJ29.BJ2 HJ29.BK2 HJ29.BS2

### Notes on the sheet
- D-BS-vp8i-0-1 Plotter Control

## Sheet 35 of 40
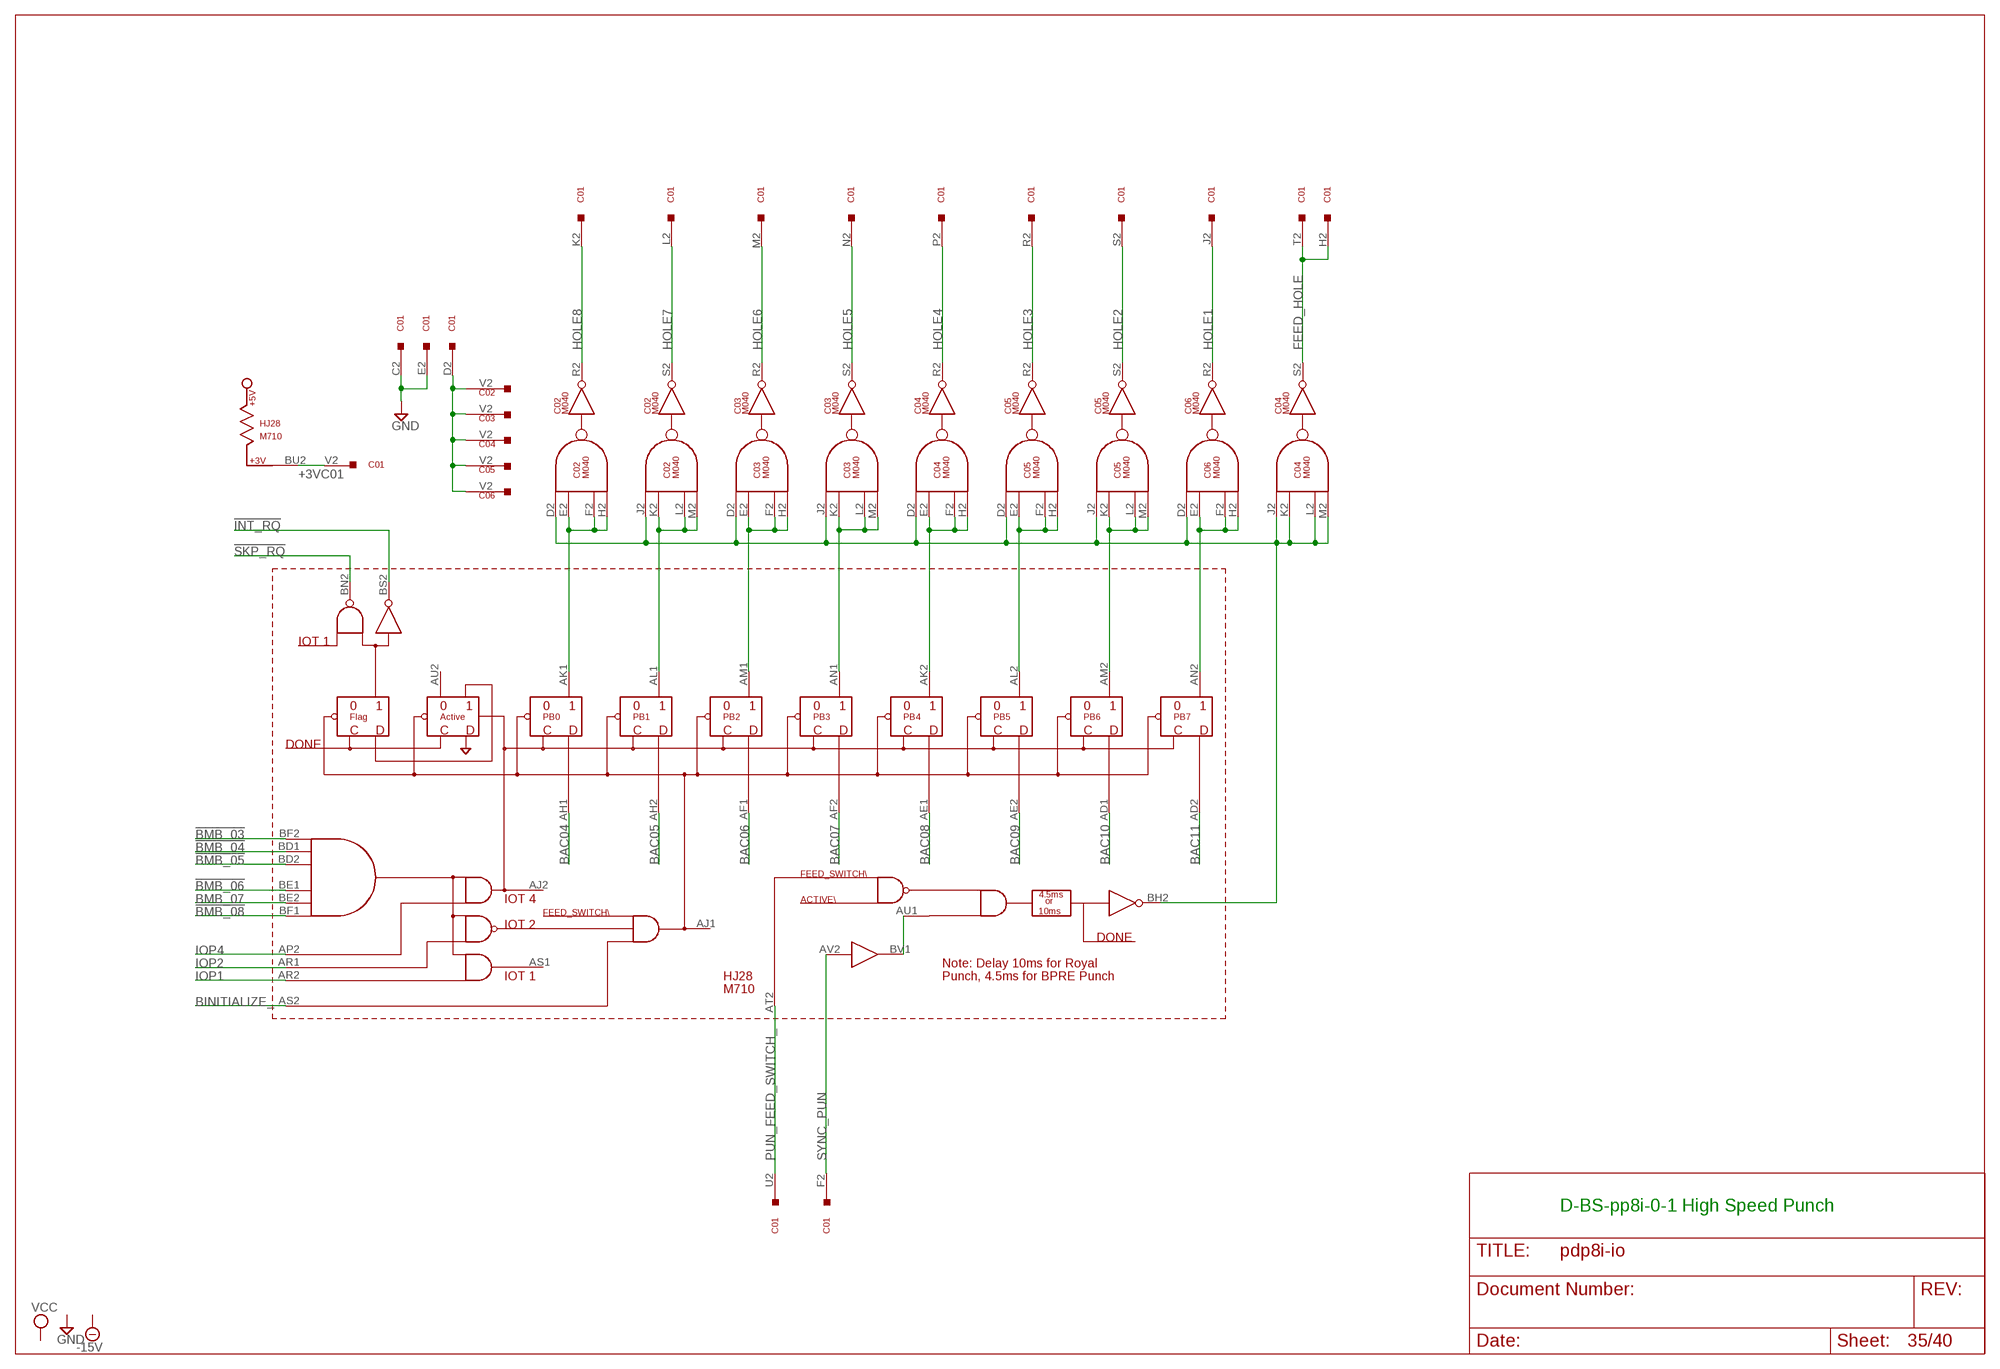
[diagram p34: schematic, sheet 35]

### Parts
C01  W023  [H807]
C02  M040  [H807]
C03  M040  [H807]
C04  M040  [H807]
C05  M040  [H807]
C06  M040  [H807]
HJ28  M710  [H807-2]

### Nets
!BMB_03: HJ28.BF2 ; also sheet 13,15,16,33,36,37
!BMB_04: HJ28.BD1 ; also sheet 13,15,16,33,34,36,37
!BMB_05: HJ28.BD2 ; also sheet 13,15,16,33,36,38
!BMB_06: HJ28.BE1 ; also sheet 13,15,34,36,37,38
!BMB_08: HJ28.BF1 ; also sheet 13,16,33,34
!INT_RQ: HJ28.BS2 ; also sheet 13,33,34,36,37,38
!SKP_RQ: HJ28.BN2 ; also sheet 13,33,34,36,37,38
+3VC01: C01.V2 HJ28.BU2
-36V: C01.D2 C02.V2 C03.V2 C04.V2 C05.V2 C06.V2
BAC04: HJ28.AH1 ; also sheet 13,14,16,33,37
BAC05: HJ28.AH2 ; also sheet 13,14,16,33,37
BAC06: HJ28.AF1 ; also sheet 13,14,16,33,37
BAC07: HJ28.AF2 ; also sheet 13,14,16,33,37
BAC08: HJ28.AE1 ; also sheet 13,14,16,33,37
BAC09: HJ28.AE2 ; also sheet 13,14,16,33,37
BAC10: HJ28.AD1 ; also sheet 13,14,16,33,37
BAC11: HJ28.AD2 ; also sheet 13,14,16,33,37
BINITIALIZE_: HJ28.AS2 ; also sheet 14,36,37,38,39
BMB_07: HJ28.BE2 ; also sheet 13,15,33,34,37,38
FEED_HOLE: C01.H2 C01.T2 C04.S2(R)
GND [Suppply]: C01.C2 C01.E2 ; also sheet 13,15,16,33,34,39
HOLE1: C01.J2 C06.R2(R)
HOLE2: C01.S2 C05.S2(R)
HOLE3: C01.R2 C05.R2(R)
HOLE4: C01.P2 C04.R2(R)
HOLE5: C01.N2 C03.S2(R)
HOLE6: C01.M2 C03.R2(R)
HOLE7: C01.L2 C02.S2(R)
HOLE8: C01.K2 C02.R2(R)
IOP1: HJ28.AR2 ; also sheet 13,15,16,33,34,36
IOP2: HJ28.AR1 ; also sheet 13,15,16,33,34,36
IOP4: HJ28.AP2 ; also sheet 13,15,16,33,34,36
N$721: HJ28.AU1 HJ28.BV1
N$722: C02.D2(D) C02.J2(D) C03.D2(D) C03.J2(D) C04.D2(D) C04.J2(D) C04.K2(E) C04.L2(F) C04.M2(H) C05.D2(D) C05.J2(D) C06.D2(D) HJ28.BH2
N$734: C02.E2(E) C02.F2(F) C02.H2(H) HJ28.AK1
N$735: C02.K2(E) C02.L2(F) C02.M2(H) HJ28.AL1
N$736: C06.E2(E) C06.F2(F) C06.H2(H) HJ28.AN2
N$737: C03.E2(E) C03.F2(F) C03.H2(H) HJ28.AM1
N$738: C03.K2(E) C03.L2(F) C03.M2(H) HJ28.AN1
N$739: C04.E2(E) C04.F2(F) C04.H2(H) HJ28.AK2
N$740: C05.E2(E) C05.F2(F) C05.H2(H) HJ28.AL2
N$741: C05.K2(E) C05.L2(F) C05.M2(H) HJ28.AM2
PUN_FEED_SWITCH_: C01.U2 HJ28.AT2
SYNC_PUN: C01.F2 HJ28.AV2
Unconnected: C01.A2 C01.B2 C06.J2(D) C06.K2(E) C06.L2(F) C06.M2(H) C06.S2(R) HJ28.AJ1 HJ28.AJ2 HJ28.AS1 HJ28.AU2

### Notes on the sheet
- IOT 4
- IOT 2
- IOT 1
- D-BS-pp8i-0-1 High Speed Punch

## Sheet 36 of 40
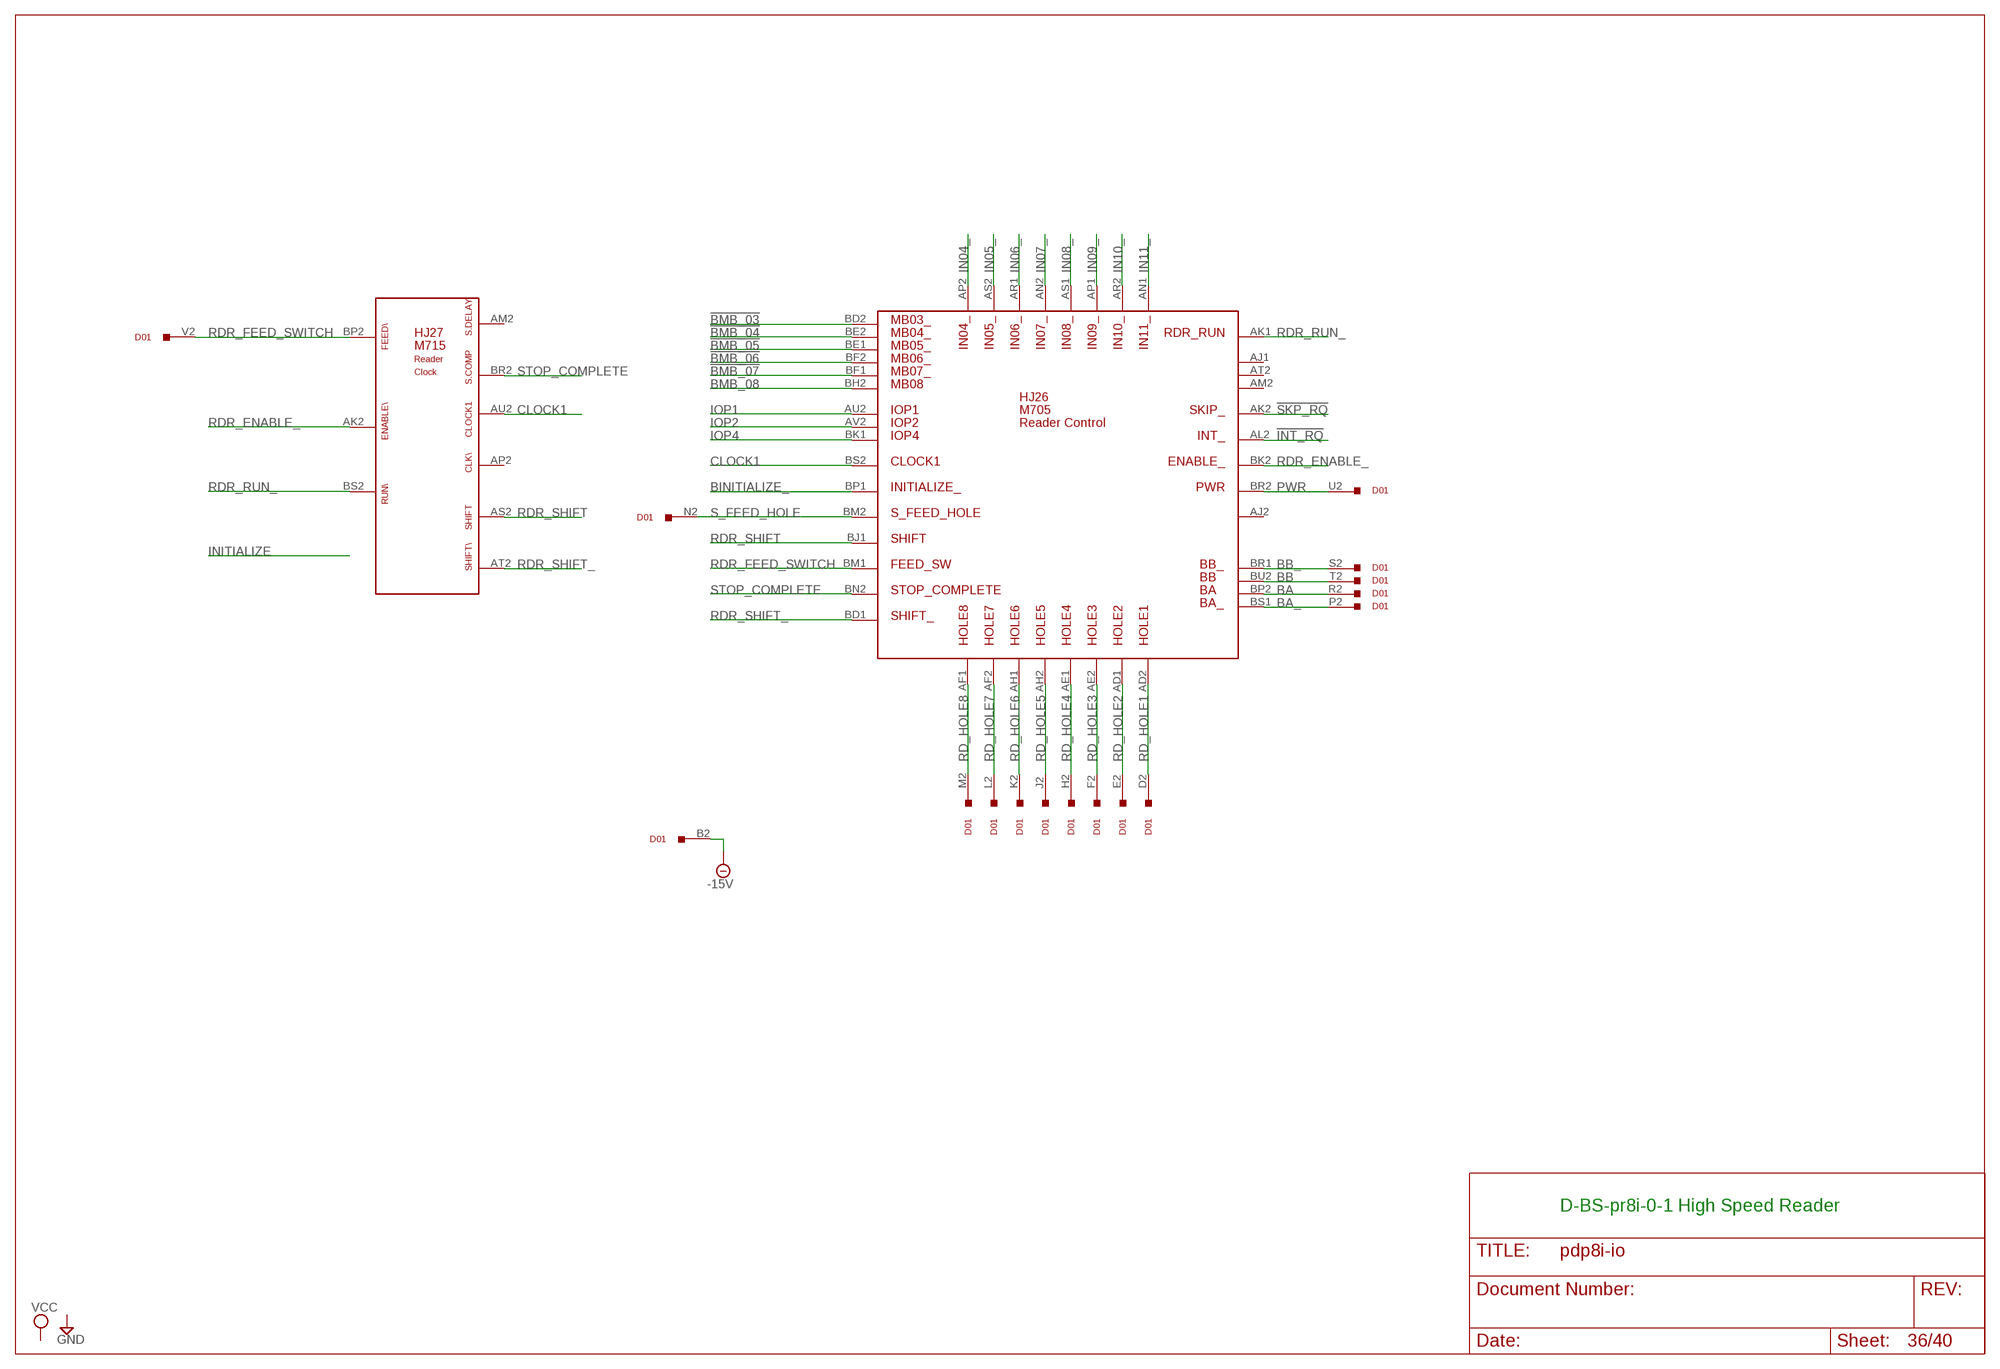
[diagram p35: schematic, sheet 36]

### Parts
D01  W077  W023  [H807]
HJ26  M705  [H807-2]
HJ27  M715  [H807-2]

### Nets
!BMB_03: HJ26.BD2 ; also sheet 13,15,16,33,35,37
!BMB_04: HJ26.BE2 ; also sheet 13,15,16,33,34,35,37
!BMB_05: HJ26.BE1 ; also sheet 13,15,16,33,35,38
!BMB_06: HJ26.BF2 ; also sheet 13,15,34,35,37,38
!BMB_07: HJ26.BF1 ; also sheet 13,16,33,34
!INT_RQ: HJ26.AL2 ; also sheet 13,33,34,35,37,38
!SKP_RQ: HJ26.AK2 ; also sheet 13,33,34,35,37,38
-15V [Suppply]: D01.B2 ; also sheet 33
BA: D01.R2 HJ26.BP2
BA_: D01.P2 HJ26.BS1
BB: D01.T2 HJ26.BU2
BB_: D01.S2 HJ26.BR1
BINITIALIZE_: HJ26.BP1 ; also sheet 14,35,37,38,39
BMB_08: HJ26.BH2 ; also sheet 13,15,33,34,37,38
CLOCK1: HJ26.BS2 HJ27.AU2(AU)
IN04_: HJ26.AP2 ; also sheet 13,37,39
IN05_: HJ26.AS2 ; also sheet 13,37,39
IN06_: HJ26.AR1 ; also sheet 13,37,39
IN07_: HJ26.AN2 ; also sheet 13,37,39
IN08_: HJ26.AS1 ; also sheet 13,37,39
IN09_: HJ26.AP1 ; also sheet 13,37,39
IN10_: HJ26.AR2 ; also sheet 13,37,39
IN11_: HJ26.AN1 ; also sheet 13,37,39
IOP1: HJ26.AU2 ; also sheet 13,15,16,33,34,35
IOP2: HJ26.AV2 ; also sheet 13,15,16,33,34,35
IOP4: HJ26.BK1 ; also sheet 13,15,16,33,34,35
PWR: D01.U2 HJ26.BR2
RD_HOLE1: D01.D2 HJ26.AD2
RD_HOLE2: D01.E2 HJ26.AD1
RD_HOLE3: D01.F2 HJ26.AE2
RD_HOLE4: D01.H2 HJ26.AE1
RD_HOLE5: D01.J2 HJ26.AH2
RD_HOLE6: D01.K2 HJ26.AH1
RD_HOLE7: D01.L2 HJ26.AF2
RD_HOLE8: D01.M2 HJ26.AF1
RDR_ENABLE_: HJ26.BK2 HJ27.AK2(AK)
RDR_FEED_SWITCH: D01.V2 HJ26.BM1 HJ27.BP2(BP)
RDR_RUN_: HJ26.AK1 HJ27.BS2(BS)
RDR_SHIFT: HJ26.BJ1 HJ27.AS2(AS)
RDR_SHIFT_: HJ26.BD1 HJ27.AT2(AT)
S_FEED_HOLE: D01.N2 HJ26.BM2
STOP_COMPLETE: HJ26.BN2 HJ27.BR2(BR)
Unconnected: D01.A2 D01.C2 HJ26.AJ1 HJ26.AJ2 HJ26.AM2 HJ26.AT2 HJ27.AM2(AM) HJ27.AP2(AP)

### Notes on the sheet
- D-BS-pr8i-0-1 High Speed Reader

## Sheet 37 of 40
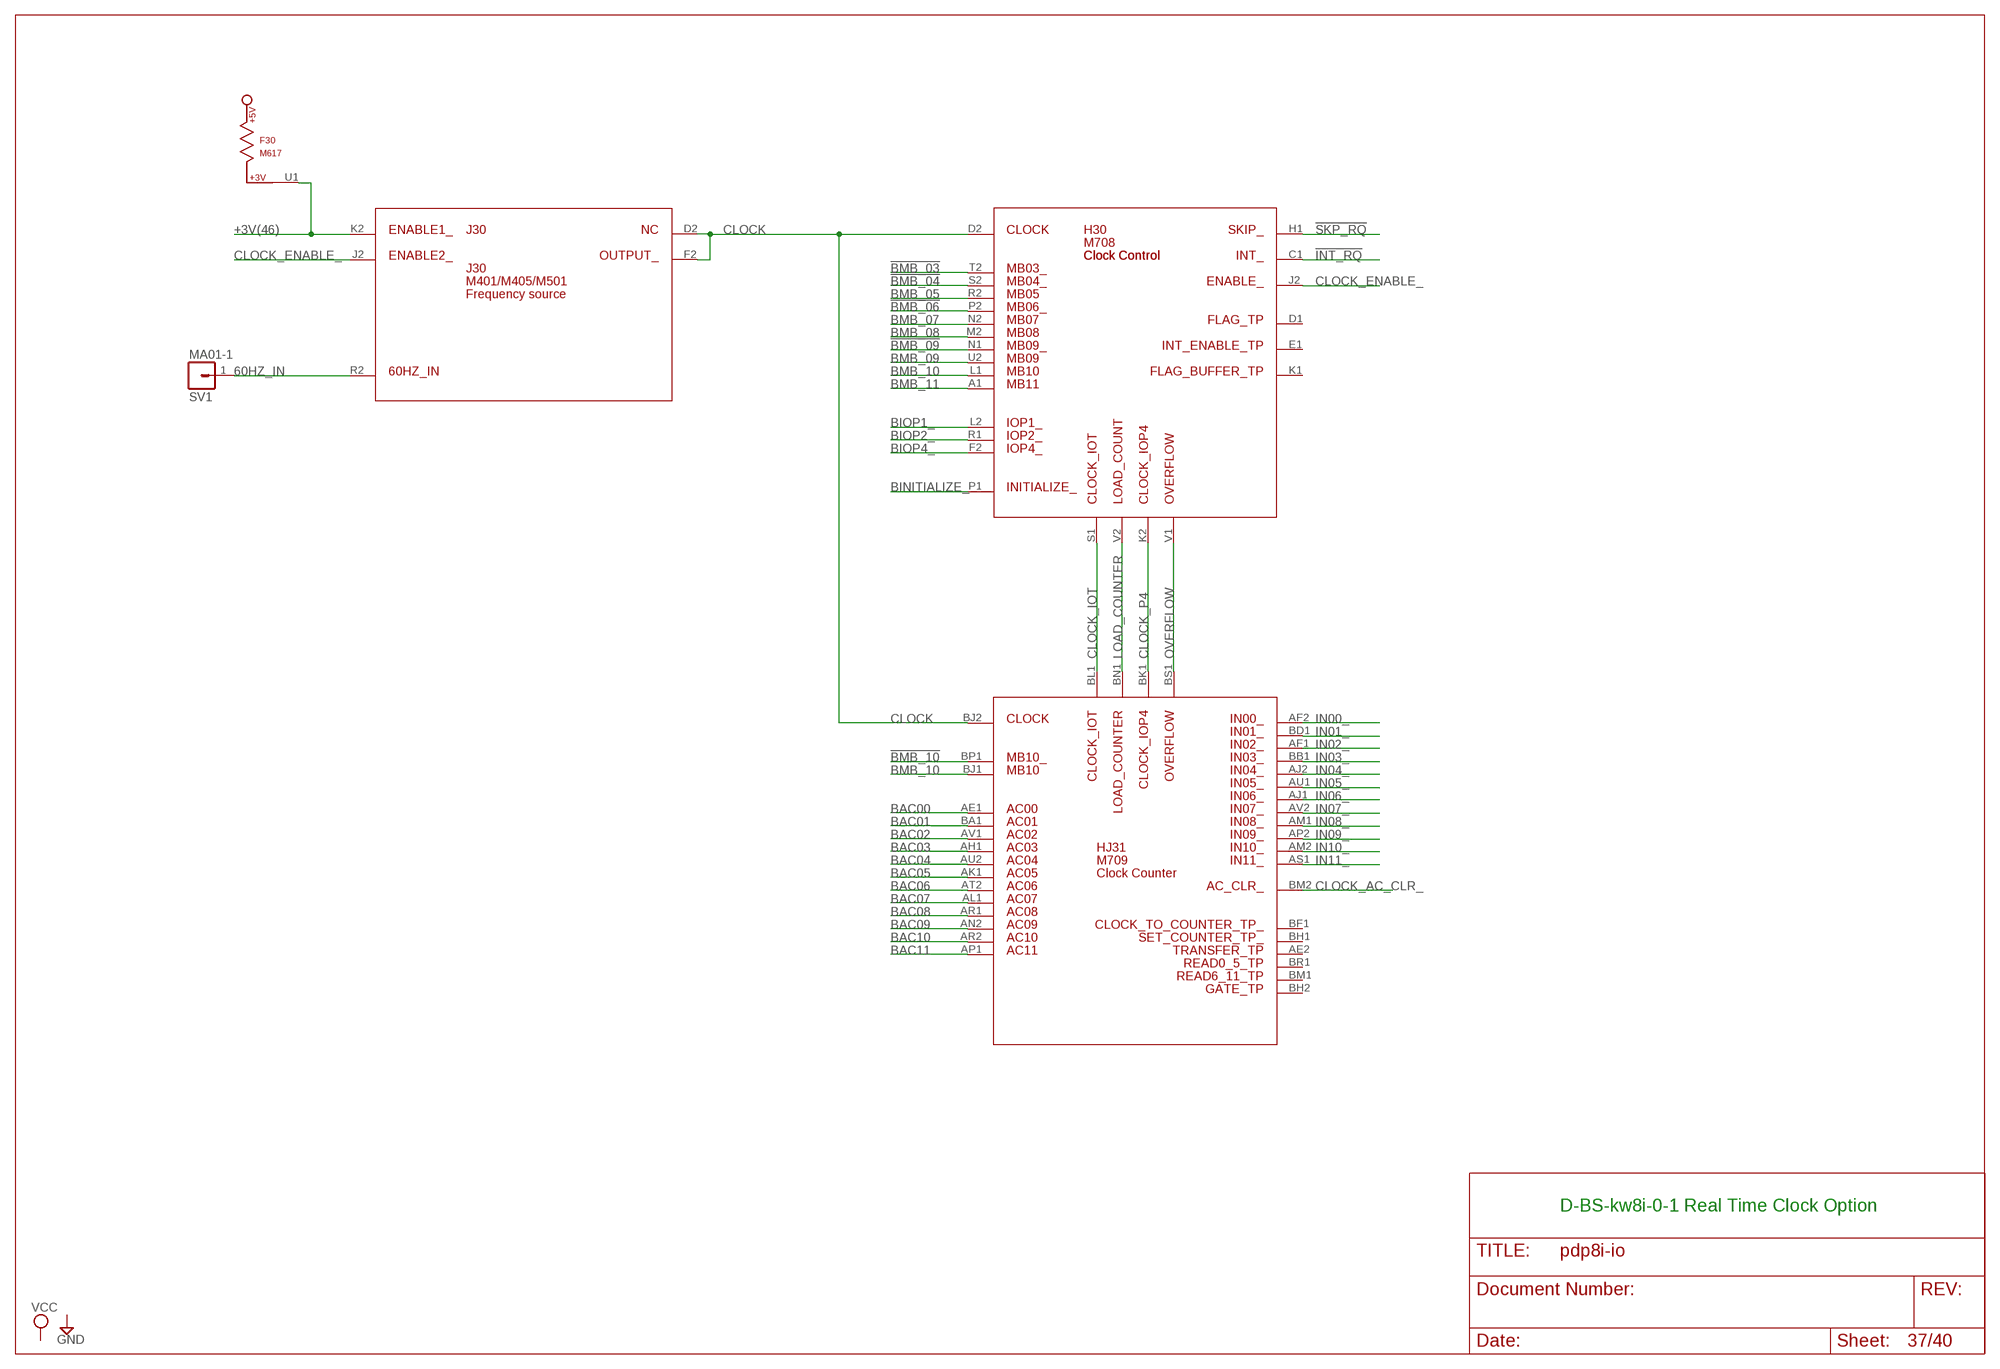
[diagram p36: schematic, sheet 37]

### Parts
F30  M617  [H807]
H30  M708  [H807]
HJ31  M709  [H807-2]
J30  M401/M405/M501  M501  [H807]
SV1  MA01-1  [MA01-1]

### Nets
60HZ_IN: J30.R2 SV1.1
!BMB_03: H30.T2 ; also sheet 13,15,16,33,35,36
!BMB_04: H30.S2 ; also sheet 13,15,16,33,34,35,36
!BMB_06: H30.P2 ; also sheet 13,15,34,35,36,38
!BMB_09: H30.N1 ; also sheet 13,33
!BMB_10: HJ31.BP1 ; also sheet 13
!INT_RQ: H30.C1 ; also sheet 13,33,34,35,36,38
!SKP_RQ: H30.H1 ; also sheet 13,33,34,35,36,38
+3V(46): F30.U1 J30.K2
BAC00: HJ31.AE1 ; also sheet 13,14
BAC01: HJ31.BA1 ; also sheet 13,14
BAC02: HJ31.AV1 ; also sheet 13,14,33
BAC03: HJ31.AH1 ; also sheet 13,14,33
BAC04: HJ31.AU2 ; also sheet 13,14,16,33,35
BAC05: HJ31.AK1 ; also sheet 13,14,16,33,35
BAC06: HJ31.AT2 ; also sheet 13,14,16,33,35
BAC07: HJ31.AL1 ; also sheet 13,14,16,33,35
BAC08: HJ31.AR1 ; also sheet 13,14,16,33,35
BAC09: HJ31.AN2 ; also sheet 13,14,16,33,35
BAC10: HJ31.AR2 ; also sheet 13,14,16,33,35
BAC11: HJ31.AP1 ; also sheet 13,14,16,33,35
BINITIALIZE_: H30.P1 ; also sheet 14,35,36,38,39
BIOP1_: H30.L2 ; also sheet 13,14,34
BIOP2_: H30.R1 ; also sheet 13,14,34
BIOP4_: H30.F2 ; also sheet 13,14
BMB_05: H30.R2 ; also sheet 13,34
BMB_07: H30.N2 ; also sheet 13,15,33,34,35,38
BMB_08: H30.M2 ; also sheet 13,15,33,34,36,38
BMB_09: H30.U2 ; also sheet 13
BMB_10: H30.L1 HJ31.BJ1 ; also sheet 13,33
BMB_11: H30.A1 ; also sheet 13,33
CLOCK: H30.D2 HJ31.BJ2 J30.D2 J30.F2
CLOCK_AC_CLR_: HJ31.BM2 ; also sheet 13
CLOCK_ENABLE_: H30.J2 J30.J2
CLOCK_IOT: H30.S1 HJ31.BL1
CLOCK_P4: H30.K2 HJ31.BK1
IN00_: HJ31.AF2 ; also sheet 13,39
IN01_: HJ31.BD1 ; also sheet 13,39
IN02_: HJ31.AF1 ; also sheet 13,39
IN03_: HJ31.BB1 ; also sheet 13,39
IN04_: HJ31.AJ2 ; also sheet 13,36,39
IN05_: HJ31.AU1 ; also sheet 13,36,39
IN06_: HJ31.AJ1 ; also sheet 13,36,39
IN07_: HJ31.AV2 ; also sheet 13,36,39
IN08_: HJ31.AM1 ; also sheet 13,36,39
IN09_: HJ31.AP2 ; also sheet 13,36,39
IN10_: HJ31.AM2 ; also sheet 13,36,39
IN11_: HJ31.AS1 ; also sheet 13,36,39
LOAD_COUNTER: H30.V2 HJ31.BN1
OVERFLOW: H30.V1 HJ31.BS1
Unconnected: F30.A1(E1:IN1) F30.B1(E1:IN2) F30.C1(E1:IN3) F30.D1(E1:IN4) F30.D2(J2:IN1) F30.E1(E1:OUT) F30.E2(J2:IN2) F30.F1(L1:IN1) F30.F2(J2:IN3) F30.H1(L1:IN2) F30.H2(J2:IN4) F30.J1(L1:IN3) F30.J2(J2:OUT) F30.K1(L1:IN4) F30.K2(P2:IN1) F30.L1(L1:OUT) F30.L2(P2:IN2) F30.M1(S1:IN1) F30.M2(P2:IN3) F30.N1(S1:IN2) F30.N2(P2:IN4) F30.P1(S1:IN3) F30.P2(P2:OUT) F30.R1(S1:IN4) F30.R2(V2:IN1) F30.S1(S1:OUT) F30.S2(V2:IN2) F30.T2(V2:IN3) F30.U2(V2:IN4) F30.V1 F30.V2(V2:OUT) H30.D1 H30.E1 H30.K1 HJ31.AE2 HJ31.BF1 HJ31.BH1 HJ31.BH2 HJ31.BM1 HJ31.BR1

### Notes on the sheet
- J30
- Clock Control
- D-BS-kw8i-0-1 Real Time Clock Option

## Sheet 38 of 40
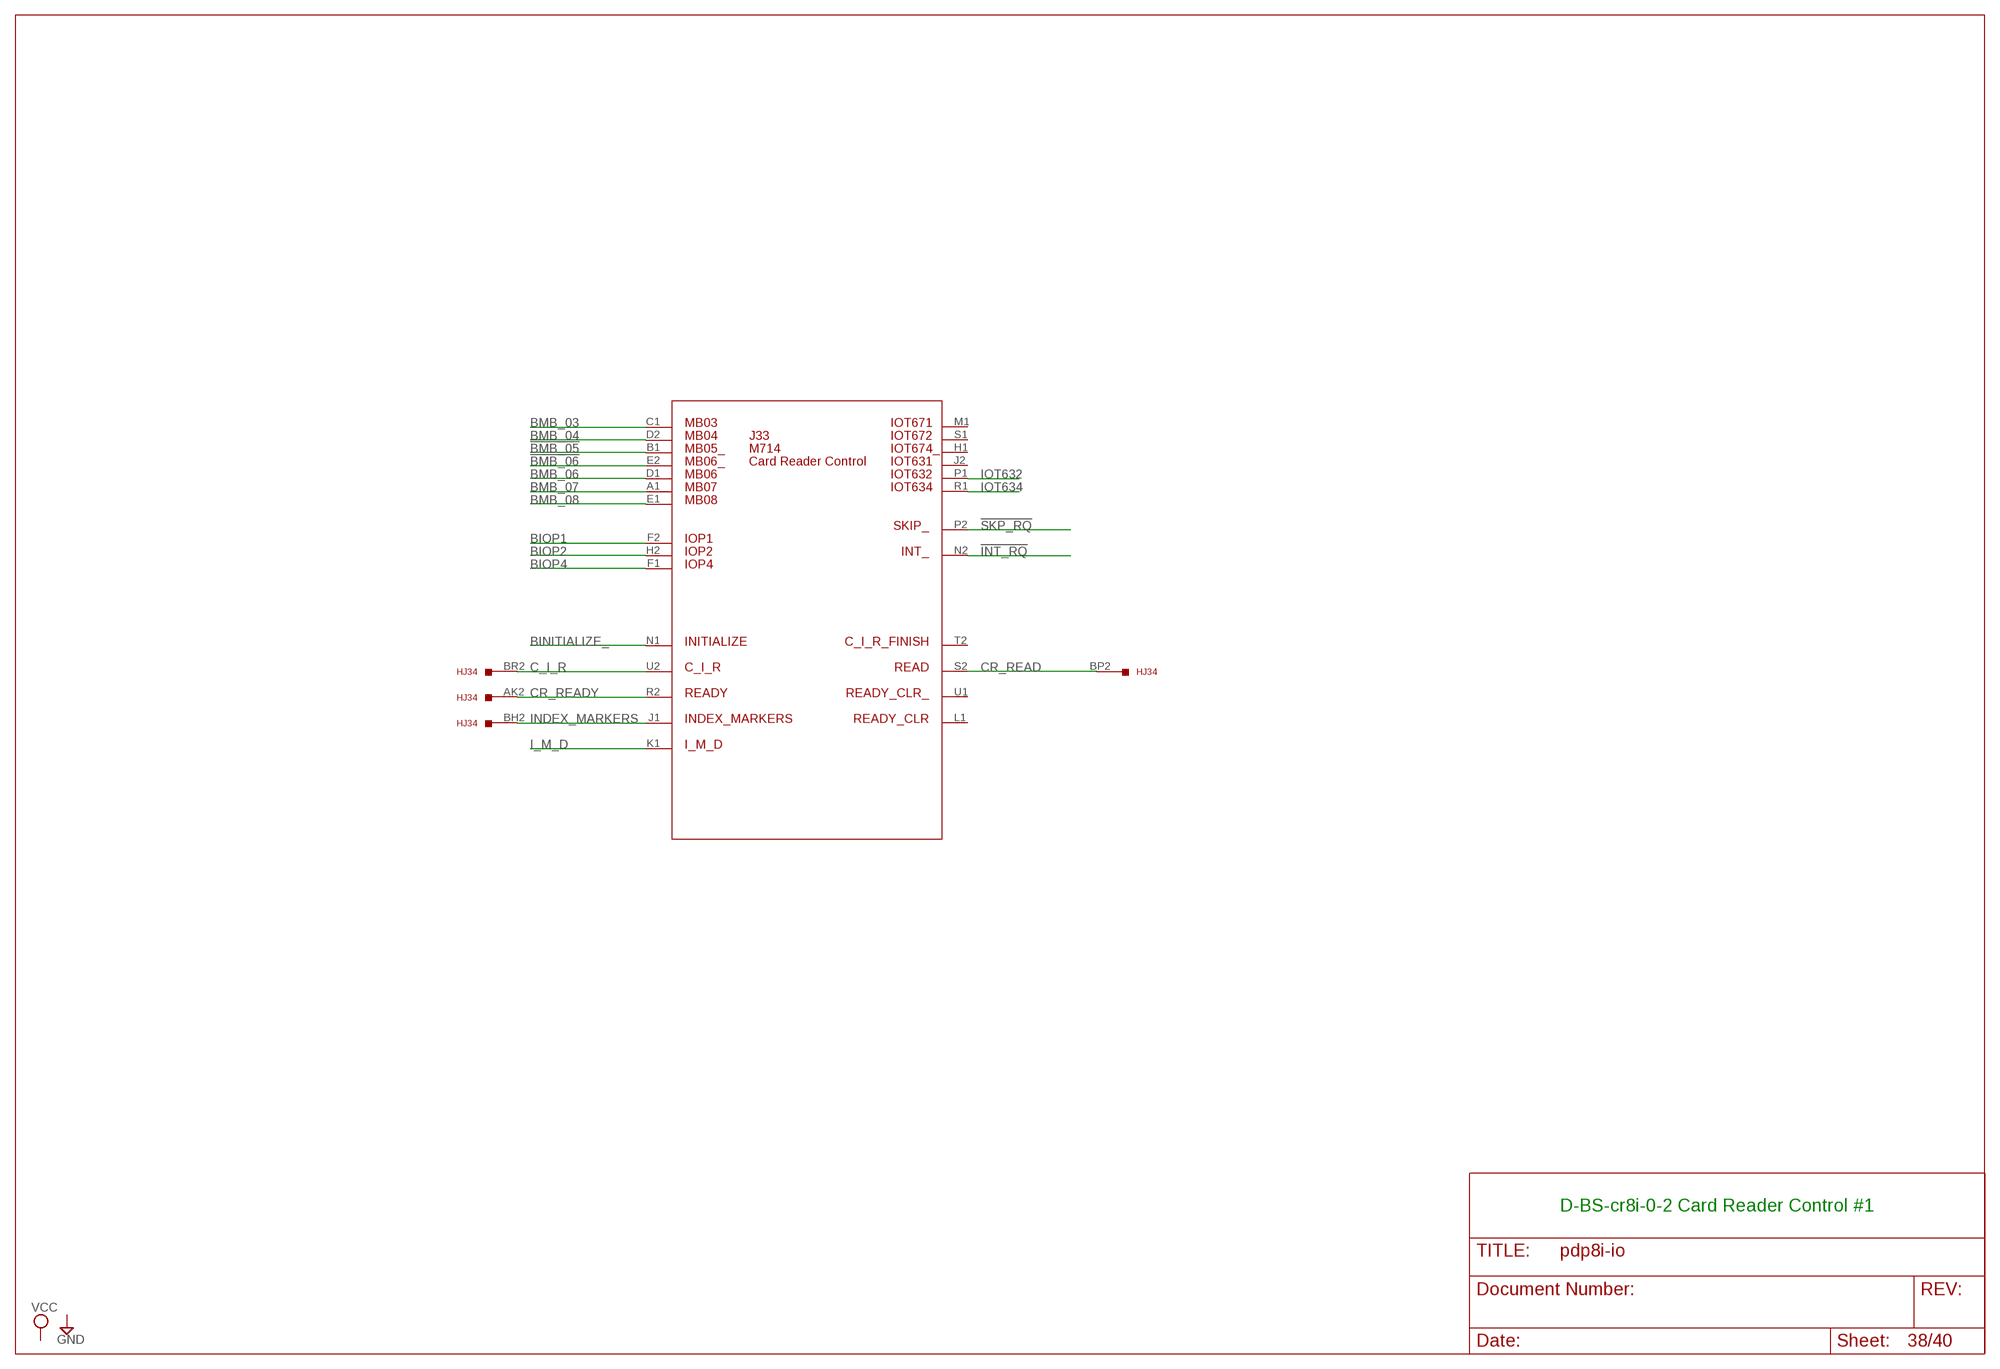
[diagram p37: schematic, sheet 38]

### Parts
HJ34  W991  [H807-2]
J33  M714  [H807]

### Nets
!BMB_05: J33.B1 ; also sheet 13,15,16,33,35,36
!BMB_06: J33.E2 ; also sheet 13,15,34,35,36,37
!INT_RQ: J33.N2 ; also sheet 13,33,34,35,36,37
!SKP_RQ: J33.P2 ; also sheet 13,33,34,35,36,37
BINITIALIZE_: J33.N1 ; also sheet 14,35,36,37,39
BIOP1: J33.F2 ; also sheet 13
BIOP2: J33.H2 ; also sheet 13
BIOP4: J33.F1 ; also sheet 13
BMB_03: J33.C1 ; also sheet 13,34
BMB_04: J33.D2 ; also sheet 13
BMB_06: J33.D1 ; also sheet 13,16,33
BMB_07: J33.A1 ; also sheet 13,15,33,34,35,37
BMB_08: J33.E1 ; also sheet 13,15,33,34,36,37
C_I_R: HJ34.BR2 J33.U2
CR_READ: HJ34.BP2 J33.S2
CR_READY: HJ34.AK2 J33.R2
I_M_D: J33.K1 ; also sheet 39
INDEX_MARKERS: HJ34.BH2 J33.J1 ; also sheet 39
IOT632: J33.P1 ; also sheet 39
IOT634: J33.R1 ; also sheet 39
Unconnected: HJ34.AA2 HJ34.AB2 HJ34.AD2 HJ34.AE2 HJ34.AF2 HJ34.AH2 HJ34.AJ2 HJ34.AL2 HJ34.AM2 HJ34.AN2 HJ34.AP2 HJ34.AR2 HJ34.AS2 HJ34.AT2 HJ34.AU2 HJ34.AV2 HJ34.BA2 HJ34.BB2 J33.H1 J33.J2 J33.L1 J33.M1 J33.S1 J33.T2 J33.U1

### Notes on the sheet
- D-BS-cr8i-0-2 Card Reader Control #1

## Sheet 39 of 40
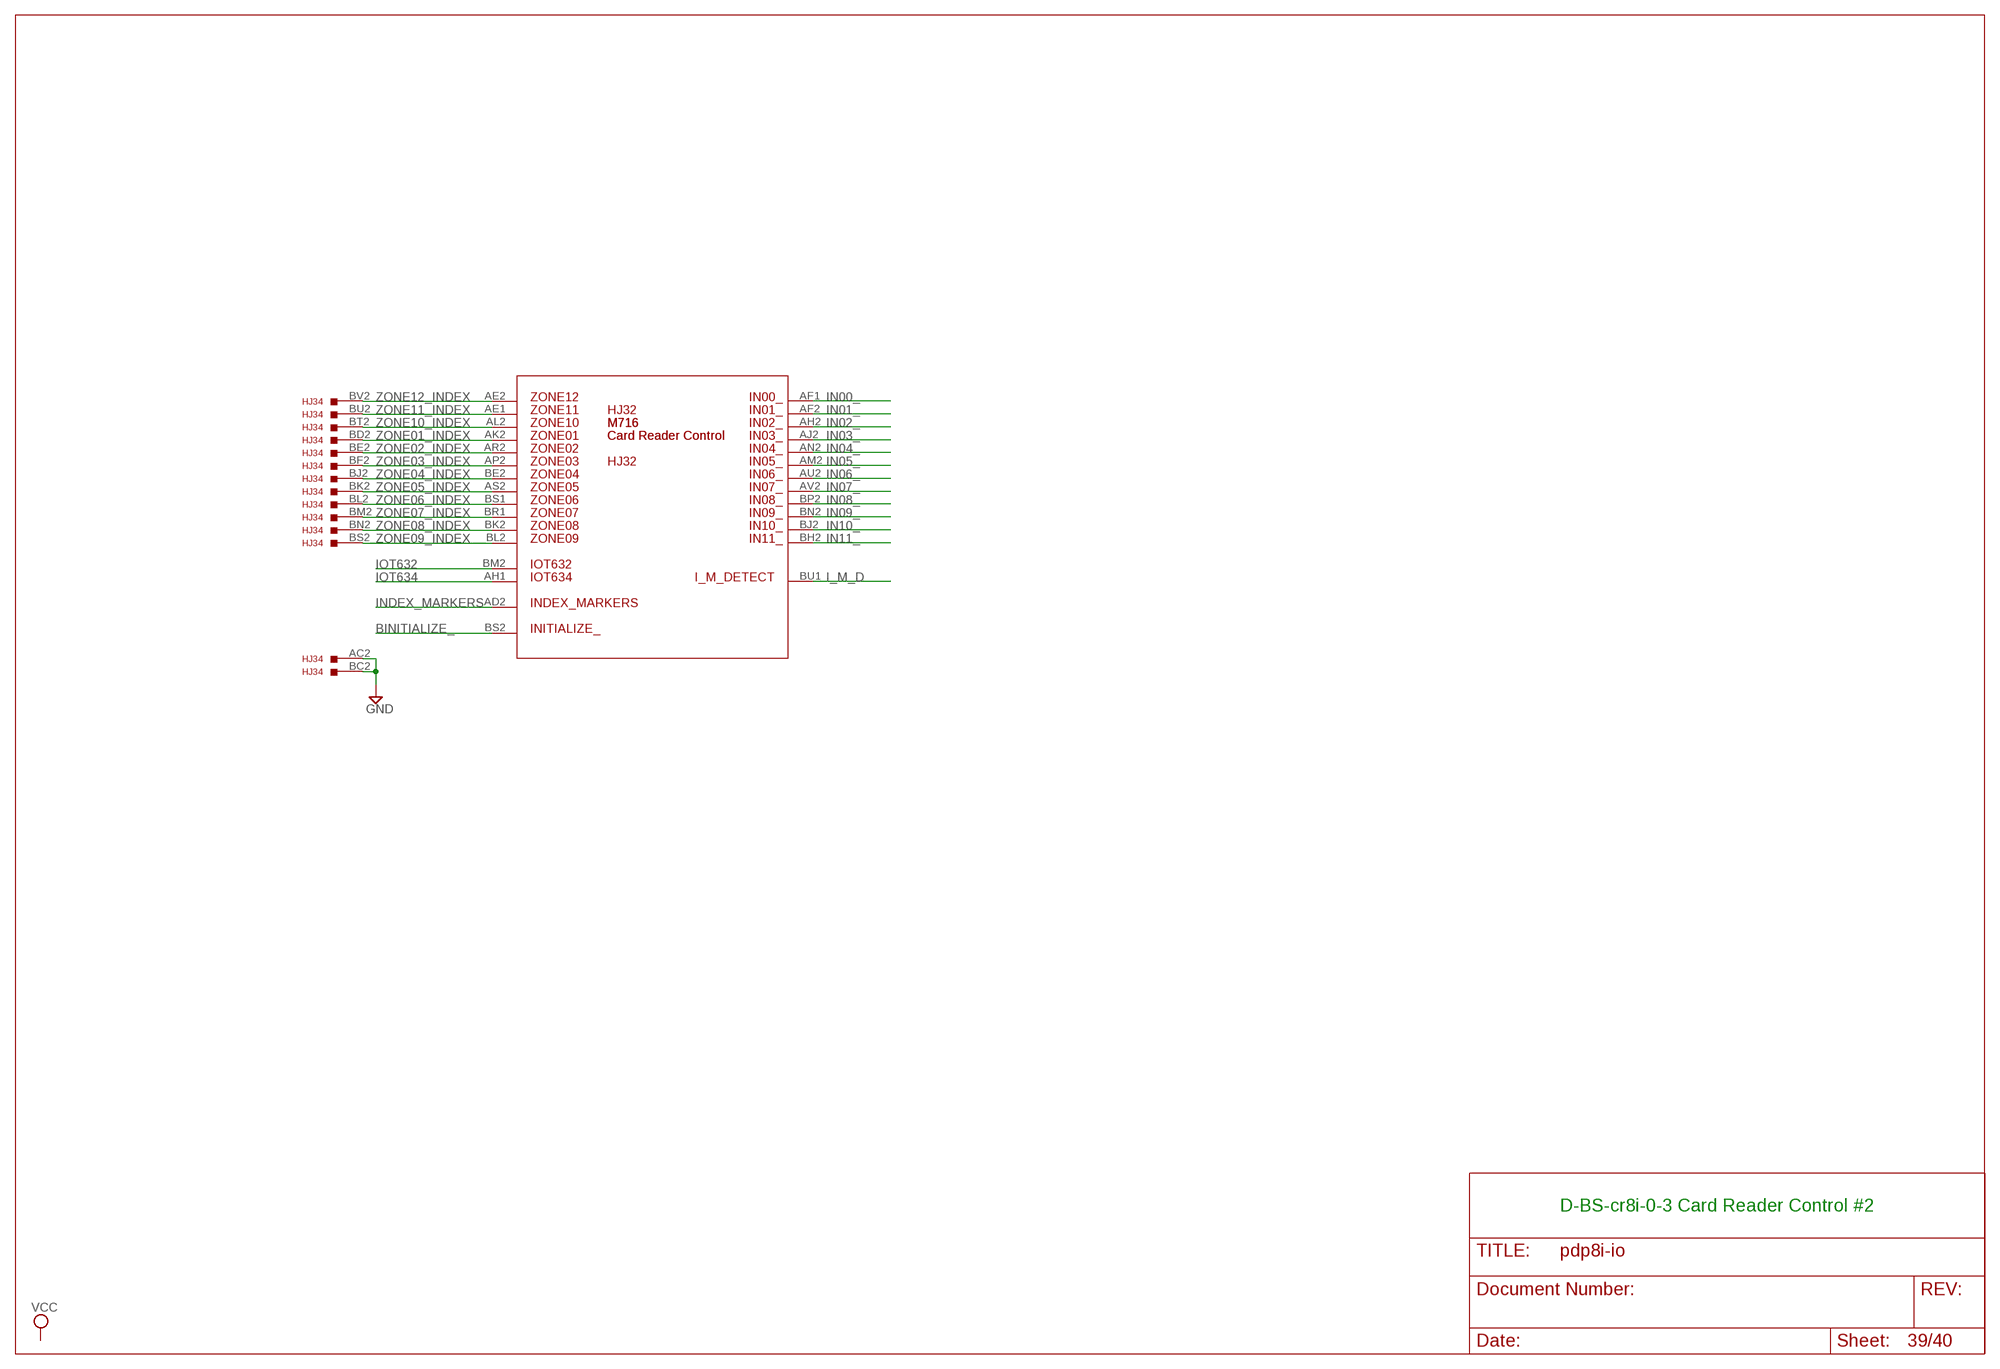
[diagram p38: schematic, sheet 39]

### Parts
HJ32  M716  [H807-2]

### Nets
BINITIALIZE_: HJ32.BS2 ; also sheet 14,35,36,37,38
GND [Suppply]: HJ34.AC2 HJ34.BC2 ; also sheet 13,15,16,33,34,35
I_M_D: HJ32.BU1 ; also sheet 38
IN00_: HJ32.AF1 ; also sheet 13,37
IN01_: HJ32.AF2 ; also sheet 13,37
IN02_: HJ32.AH2 ; also sheet 13,37
IN03_: HJ32.AJ2 ; also sheet 13,37
IN04_: HJ32.AN2 ; also sheet 13,36,37
IN05_: HJ32.AM2 ; also sheet 13,36,37
IN06_: HJ32.AU2 ; also sheet 13,36,37
IN07_: HJ32.AV2 ; also sheet 13,36,37
IN08_: HJ32.BP2 ; also sheet 13,36,37
IN09_: HJ32.BN2 ; also sheet 13,36,37
IN10_: HJ32.BJ2 ; also sheet 13,36,37
IN11_: HJ32.BH2 ; also sheet 13,36,37
INDEX_MARKERS: HJ32.AD2 ; also sheet 38
IOT632: HJ32.BM2 ; also sheet 38
IOT634: HJ32.AH1 ; also sheet 38
ZONE01_INDEX: HJ32.AK2 HJ34.BD2
ZONE02_INDEX: HJ32.AR2 HJ34.BE2
ZONE03_INDEX: HJ32.AP2 HJ34.BF2
ZONE04_INDEX: HJ32.BE2 HJ34.BJ2
ZONE05_INDEX: HJ32.AS2 HJ34.BK2
ZONE06_INDEX: HJ32.BS1 HJ34.BL2
ZONE07_INDEX: HJ32.BR1 HJ34.BM2
ZONE08_INDEX: HJ32.BK2 HJ34.BN2
ZONE09_INDEX: HJ32.BL2 HJ34.BS2
ZONE10_INDEX: HJ32.AL2 HJ34.BT2
ZONE11_INDEX: HJ32.AE1 HJ34.BU2
ZONE12_INDEX: HJ32.AE2 HJ34.BV2

### Notes on the sheet
- M716
- Card Reader Control
- HJ32
- D-BS-cr8i-0-3 Card Reader Control #2

## Sheet 40 of 40
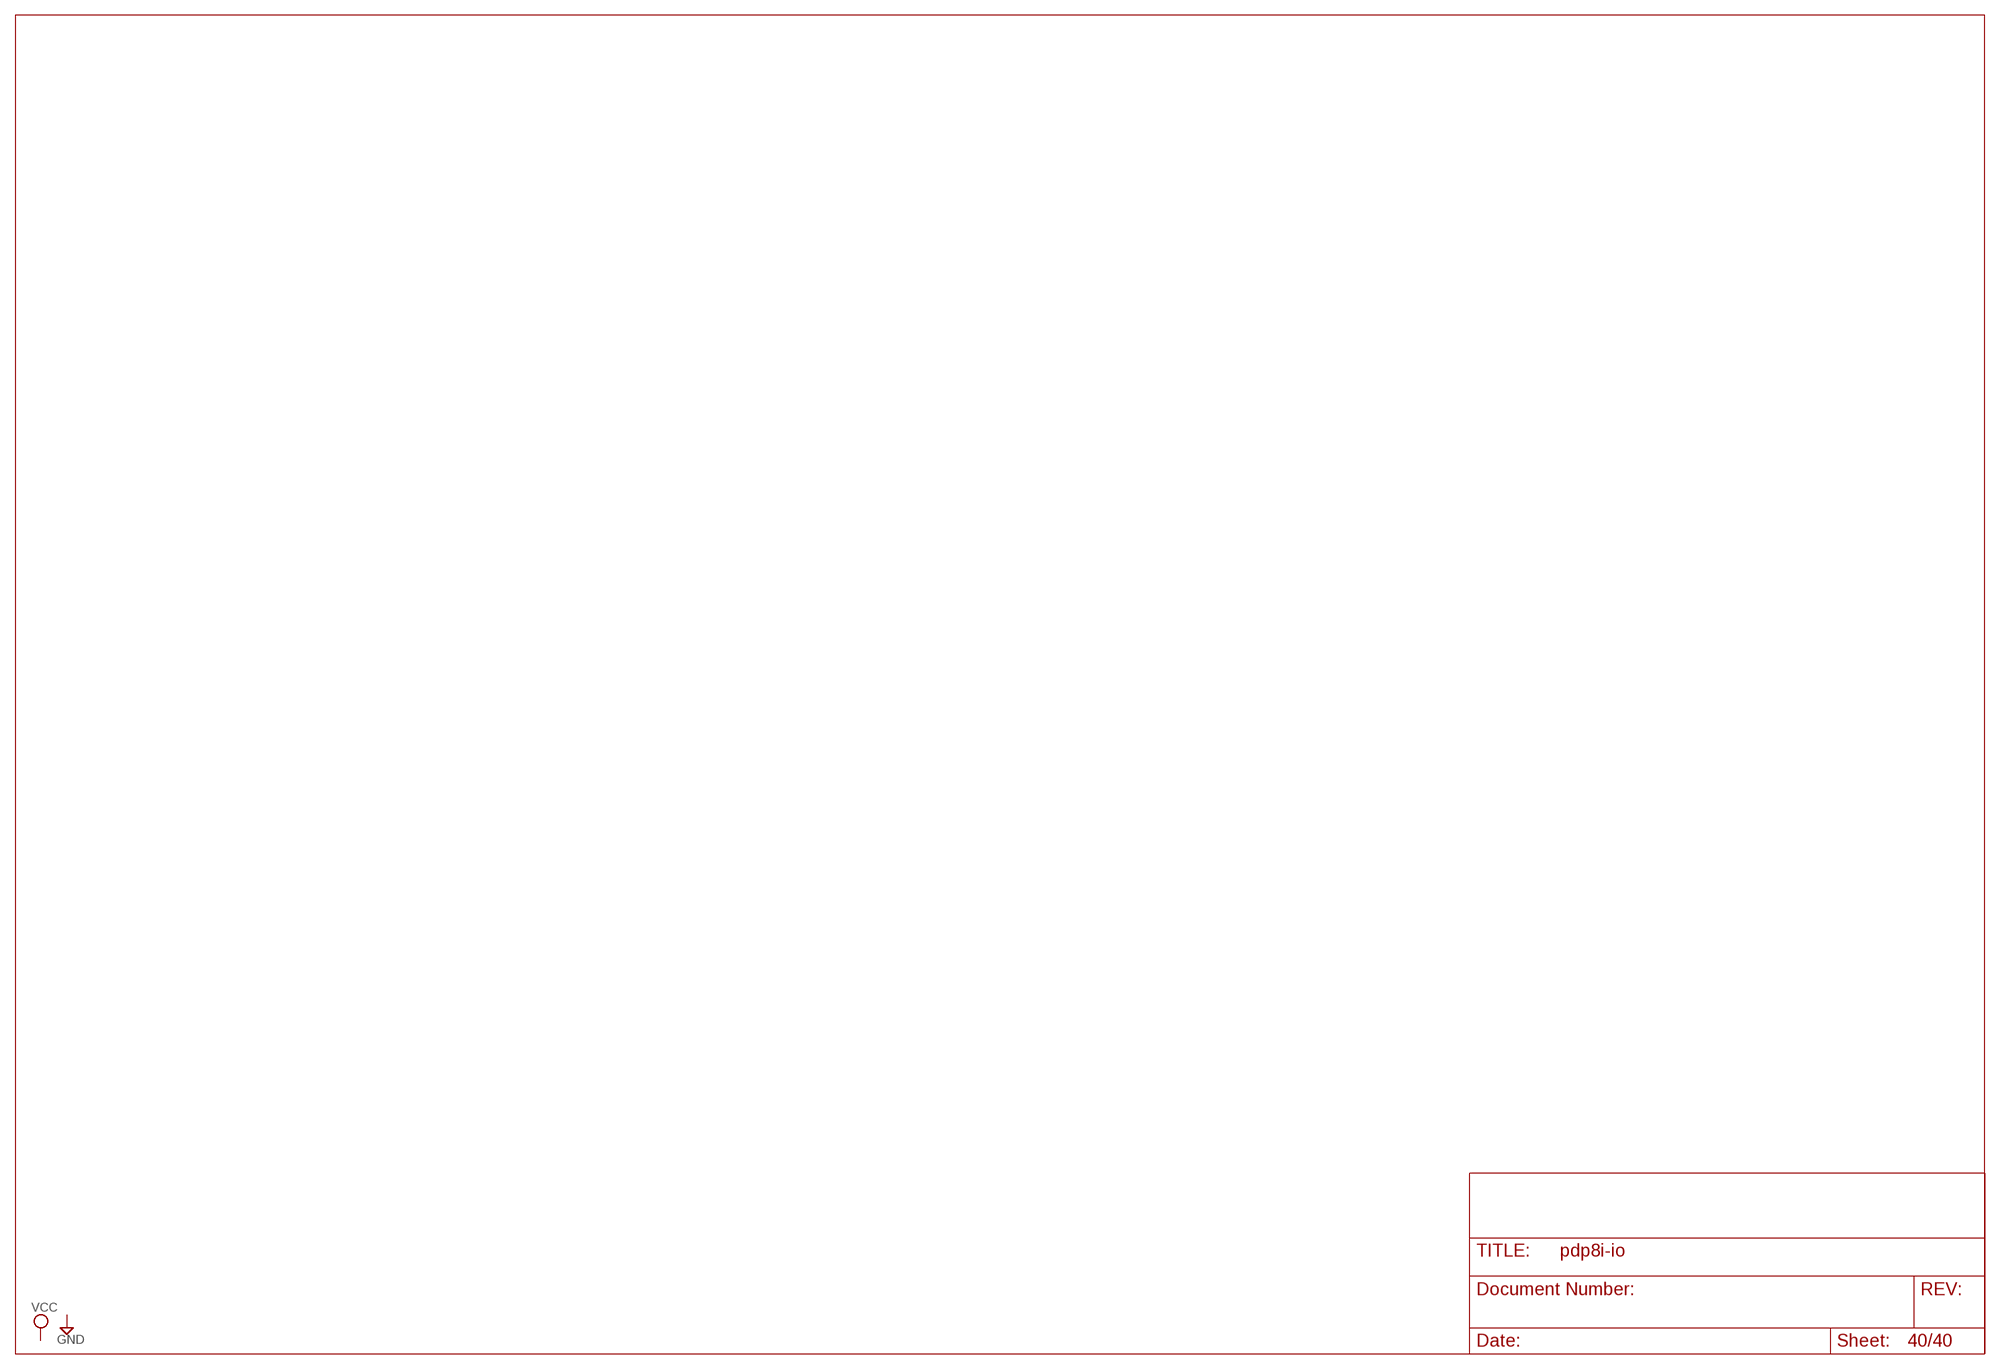
[diagram p39: schematic, sheet 40]

## Power pins joined to a net without a drawn wire
-15V: C02.B2(-15V) C03.B2(-15V) C04.B2(-15V) C05.B2(-15V) C06.B2(-15V) E03.B2 E04.B2 E05.B2 E06.B2 E07.B2 E08.B2 F04.B2 F05.B2 F06.B2 F07.B2 H06.B2 H21.B2 H22.B2 H33.B2 H35.B2 H36.B2 H37.B2 H38.B2 H39.B2 H40.B2 HJ24.AB2(-15V) HJ24.BB2(-15V) HJ25.AB2(-15V) HJ25.BB2(-15V) HJ27.BB2(-15V) J12.B2(-15V) J21.B2 J22.B2 J35.B2 J36.B2 J37.B2 J38.B2 J39.B2 J40.B2
GND: B04.C2(GND) B04.T1(GND) B04.U1(GND) B04.V1(GND) B05.C2(GND) B05.T1(GND) B05.U1(GND) B05.V1(GND) BAC.A1 BAC.C1 BAC.C2 BAC.F1 BAC.F2 BAC.J2 BAC.K1 BAC.L2 BAC.N1 BAC.N2 BAC.R1 BAC.R2 BAC.T1 BAC.U2 BMB.A1 BMB.C1 BMB.C2 BMB.F1 BMB.F2 BMB.J2 BMB.K1 BMB.L2 BMB.N1 BMB.N2 BMB.R1 BMB.R2 BMB.T1 BMB.U2 C02.C2(GND) C03.C2(GND) C04.C2(GND) C05.C2(GND) C06.C2(GND) C07.C2(GND) C07.T1(GND) C09.C2(GND) C09.T1(GND) E03.C2 E04.C2 E05.C2 E06.C2 E07.C2 E08.C2 EF01.AC2(GND) EF01.AT1(GND) EF01.BC2(GND) EF01.BT1(GND) EF02.AC2(GND) EF02.AT1(GND) EF02.BC2(GND) EF02.BT1(GND) F03.C2(GND) F04.C2 F05.C2 F06.C2 F07.C2 F30.C2(GND) F30.T1(GND) H06.C2 H21.C2 H22.C2 H30.C2(GND) H30.T1(GND) H33.C2 H35.C2 H36.C2 H37.C2 H38.C2 H39.C2 H40.C2 HJ23.AC2(GND) HJ23.AT1(GND) HJ23.BC2(GND) HJ23.BT1(GND) HJ24.AC2(GND) HJ24.BC2(GND) HJ25.AC2(GND) HJ25.BC2(GND) HJ26.AC2(GND) HJ26.AT1(GND) HJ26.BC2(GND) HJ26.BT1(GND) HJ27.AC2(GND) HJ27.BC2(GND) HJ28.AC2(GND) HJ28.AT1(GND) HJ28.BC2(GND) HJ28.BT1(GND) HJ29.AC2(GND) HJ29.AT1(GND) HJ29.BC2(GND) HJ29.BT1(GND) HJ31.AC2(GND) HJ31.AT1(GND) HJ31.BC2(GND) HJ31.BT1(GND) HJ32.AC2(GND) HJ32.AT1(GND) HJ32.BC2(GND) HJ32.BT1(GND) IN.A1 IN.C1 IN.C2 IN.F1 IN.F2 IN.J2 IN.K1 IN.L2 IN.N1 IN.N2 IN.R1 IN.R2 IN.T1 IN.U2 J01.C2 J01.F2 J01.J2 J01.L2 J01.N2 J01.R2 J01.U2 J02.C2 J02.F2 J02.J2 J02.L2 J02.N2 J02.R2 J02.U2 J03.C2 J03.F2 J03.J2 J03.L2 J03.N2 J03.R2 J03.U2 J04.C2 J04.F2 J04.J2 J04.L2 J04.N2 J04.R2 J04.U2 J05.C2 J05.F2 J05.J2 J05.L2 J05.N2 J05.R2 J05.U2 J06.C2 J06.F2 J06.J2 J06.L2 J06.N2 J06.R2 J06.U2 J12.C2(GND) J21.C2 J22.C2 J30.C2(GND) J33.C2(GND) J33.T1(GND) J35.C2 J36.C2 J37.C2 J38.C2 J39.C2 J40.C2 TTIBUF.C2(GND) TTIBUF.T1(GND) TTIBUF.U1(GND) TTIBUF.V1(GND)
VCC: B04.A2(VCC) B05.A2(VCC) C02.A2(VCC) C03.A2(VCC) C04.A2(VCC) C05.A2(VCC) C06.A2(VCC) C07.A2(VCC) C09.A2(VCC) E03.A2 E04.A2 E05.A2 E06.A2 E07.A2 E08.A2 EF01.AA2(VCC) EF01.BA2(VCC) EF02.AA2(VCC) EF02.BA2(VCC) F03.A2(VCC) F04.A2 F05.A2 F06.A2 F07.A2 F30.A2(VCC) H06.A2 H21.A2 H22.A2 H30.A2(VCC) H33.A2 H35.A2 H36.A2 H37.A2 H38.A2 H39.A2 H40.A2 HJ23.AA2(VCC) HJ23.BA2(VCC) HJ24.AA2(VCC) HJ24.BA2(VCC) HJ25.AA2(VCC) HJ25.BA2(VCC) HJ26.AA2(VCC) HJ26.BA2(VCC) HJ27.AA2(VCC) HJ27.BA2(VCC) HJ28.AA2(VCC) HJ28.BA2(VCC) HJ29.AA2(VCC) HJ29.BA2(VCC) HJ31.AA2(VCC) HJ31.BA2(VCC) HJ32.AA2(VCC) HJ32.BA2(VCC) J12.A2(VCC) J21.A2 J22.A2 J30.A2(VCC) J33.A2(VCC) J35.A2 J36.A2 J37.A2 J38.A2 J39.A2 J40.A2 TTIBUF.A2(VCC)

## Library data of the parts
B04 B05 TTIBUF = dec-m:M623: 6 Dual Bus Drivers
BAC BMB IN = dec-m:M903: Two-sided Posibus cable/connector.
C01 D01-D03 = dec-m:W023: One-sided 18 pin connector/cable.
C02-C06 = dec-m:M040: M040 Solenoid Driver
C07 C09 = dec-m:M101-ARRAY: M101 Bus Data Interface
E03-E08 F04-F07 H06 H21 H22 H33 H35-H40 J21 J22 J35-J40 = dec-m:EMPTY: Empty Slot
EF01 = dec-m:M706: M706 TTY Receiver
EF02 = dec-m:M707: M707 TTY Transmitter
F03 = dec-m:M452: M452 Baud Rate Clock
F30 = dec-m:M617: 6 4-input NAND Buffers
H30 = dec-m:M708: M708 Clock Control
HJ23 = dec-m:M701: M701 Display Control
HJ24 HJ25 = dec-m:A607: A607 Digital to Analog Converter
HJ26 = dec-m:M705: Reader Control
HJ27 = dec-m:M715: Reader Clock
HJ28 = dec-m:M710: Punch Control
HJ29 = dec-m:M704: M704 Plotter Control
HJ31 = dec-m:M709: M709 Clock Counter
HJ32 = dec-m:M716: M716 Card Reader Control
HJ34 = dec-m:W991: One-sided 36 pin (double hight) connector/cable.
J01-J06 = dec-m:W011: One-sided 9 pin connector/cable with grounds (Negibus).
J12 = dec-m:W076: W076 Terminal Connector
J30 = dec-m:M501: M401/M405/M501 Frequency Source
J33 = dec-m:M714: M714 Card Reader Control
SV1 = dec-con:MA01-1: Pin Header (.125" spacing)

## Net classes
1 Suppply: width 1.016 mm